# EasyEDA Pro project Car.epro

# Schematic Schematic1

## Sheets
1 OVERVIEW: Assembly Variant: Basic; Board Name: Board1; Create Date: 2025-12-26; Page Name: P1; Project Name: 小车v1.0; Schematic Name: Schematic1; Update Date: 2025-12-26; BladeWidth: 10; Company: 嘉立创EDA; Page Size: A4; RegionStart: 1; ShowBorder: 1; TitleBlock: 1; TitleBlockPosition: 3; Version: V1.0; XRegionCount: 6; YRegionCount: 4
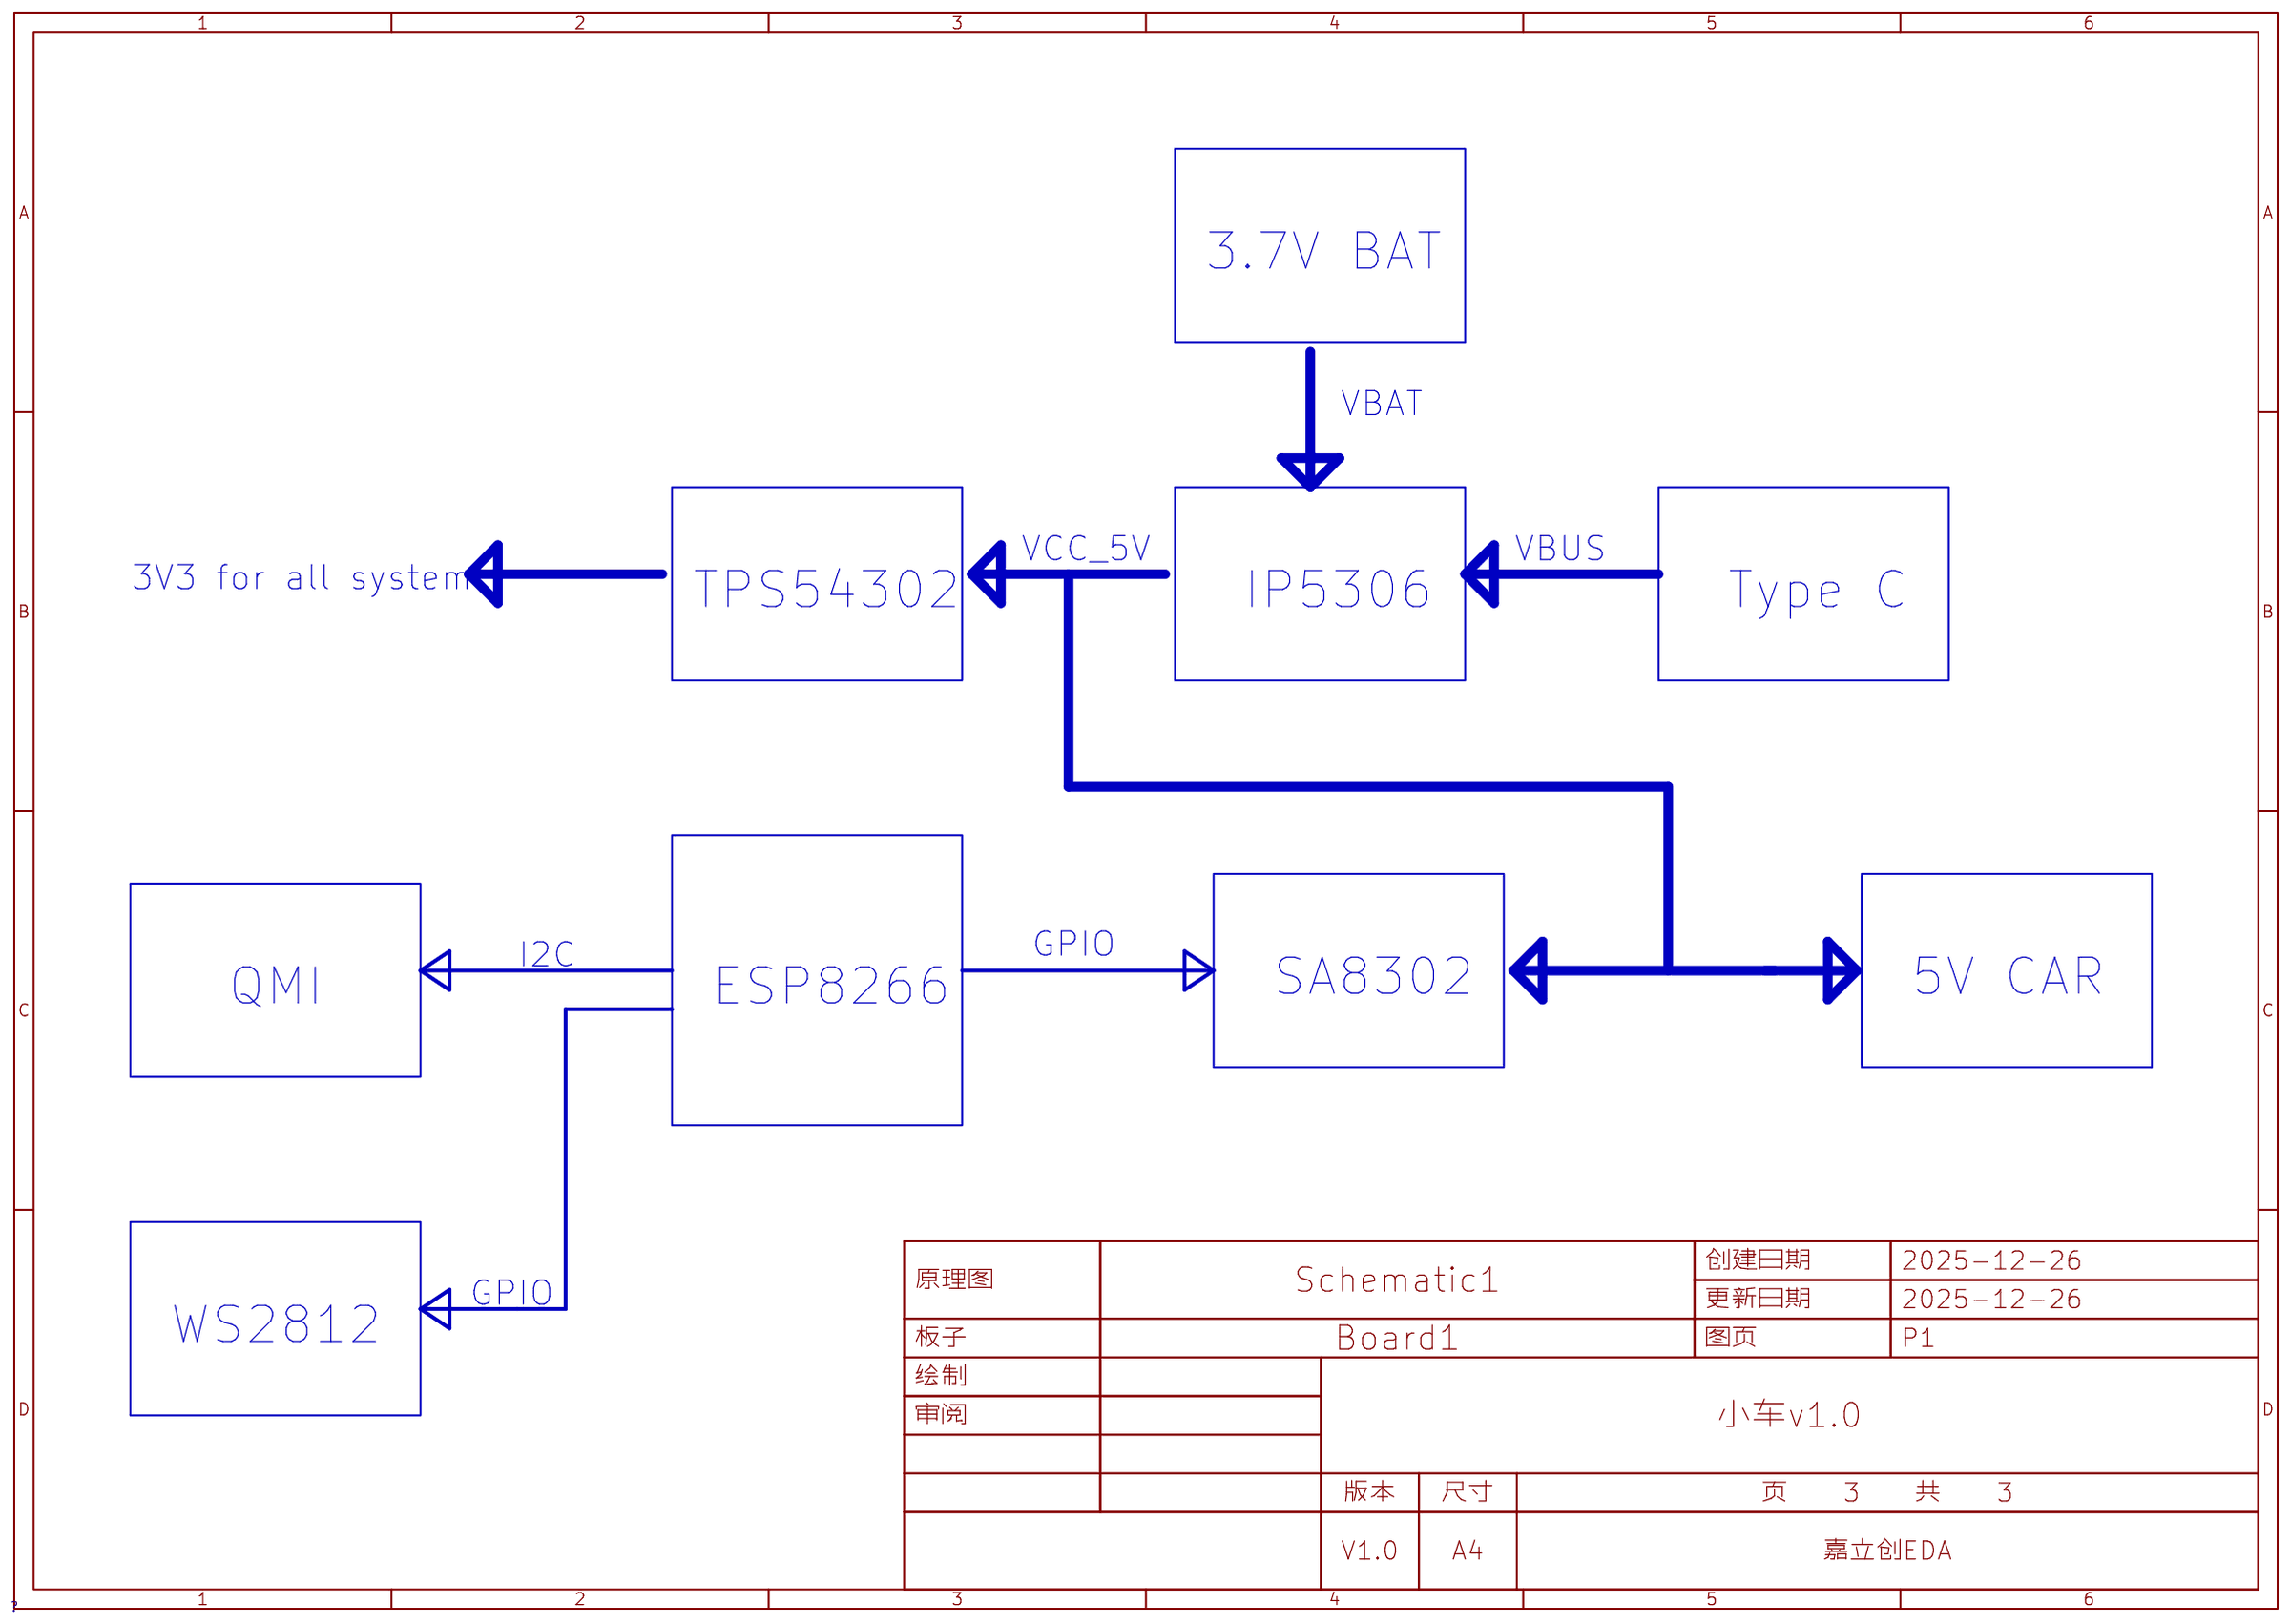
[diagram p0: OVERVIEW]
2 SENSOR: Create Date: 2026-01-07; Update Date: 2026-01-07
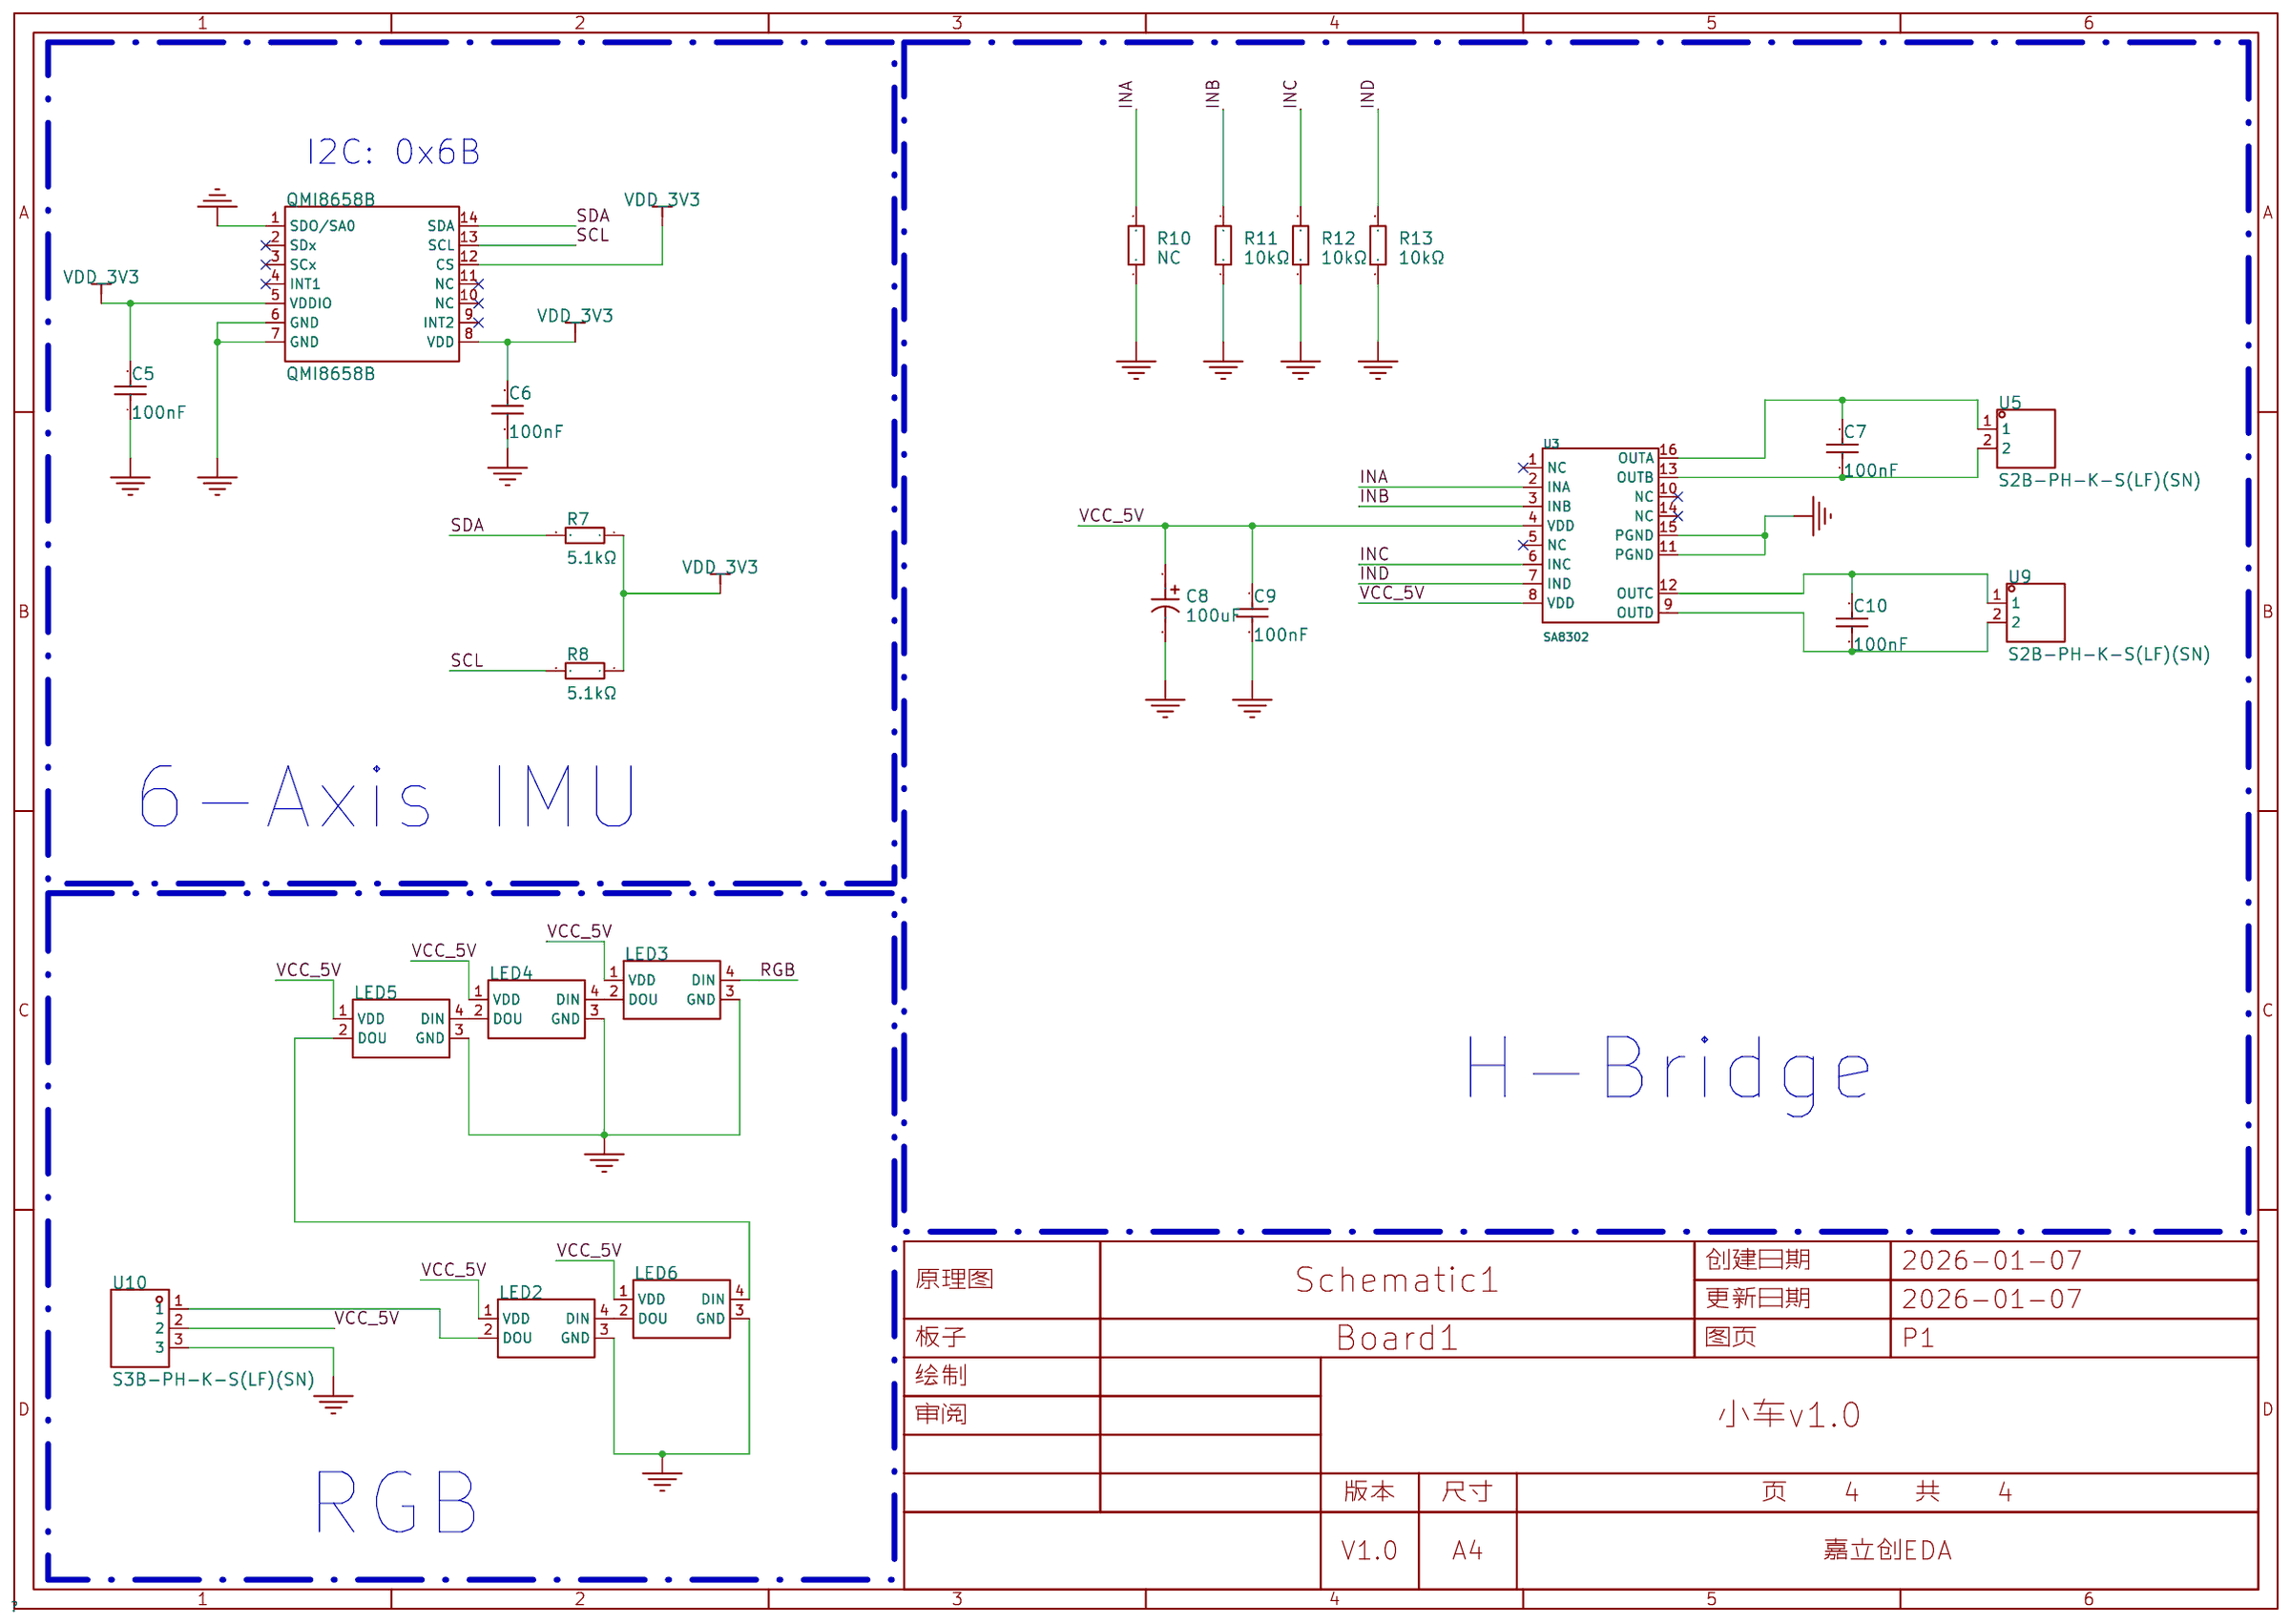
[diagram p1: SENSOR]
3 ESP8266
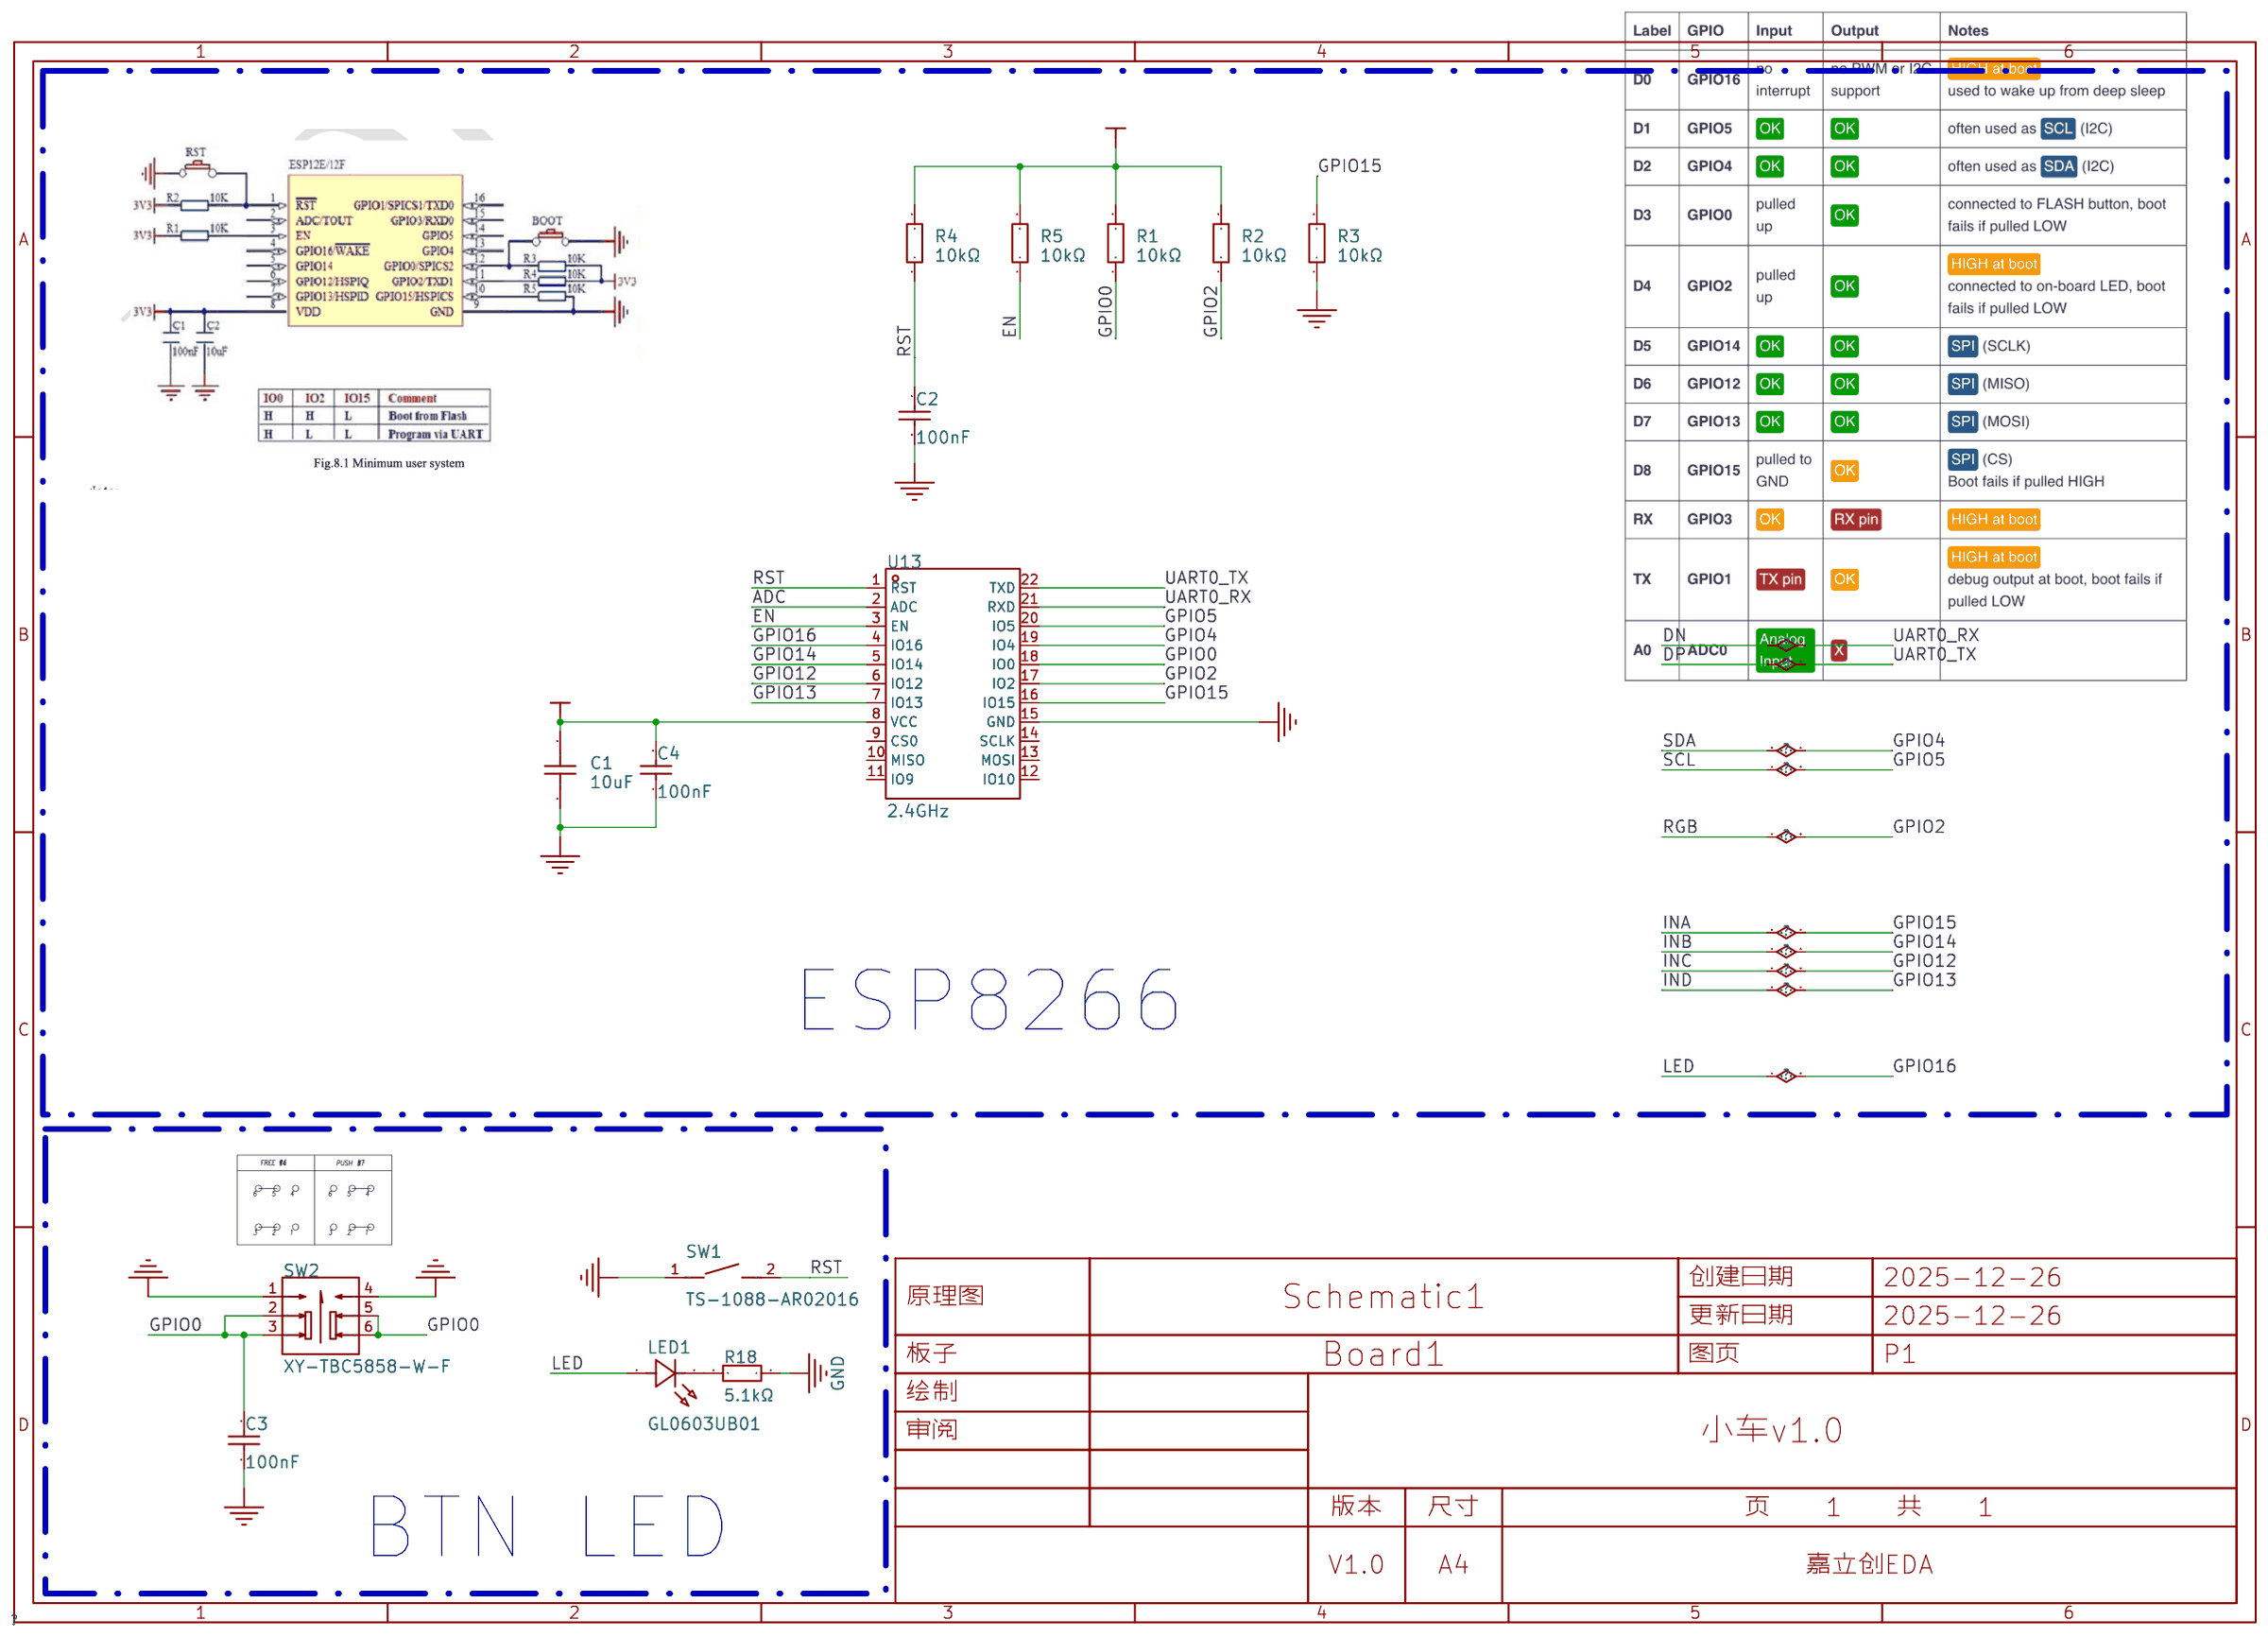
[diagram p2: ESP8266]
4 POWER
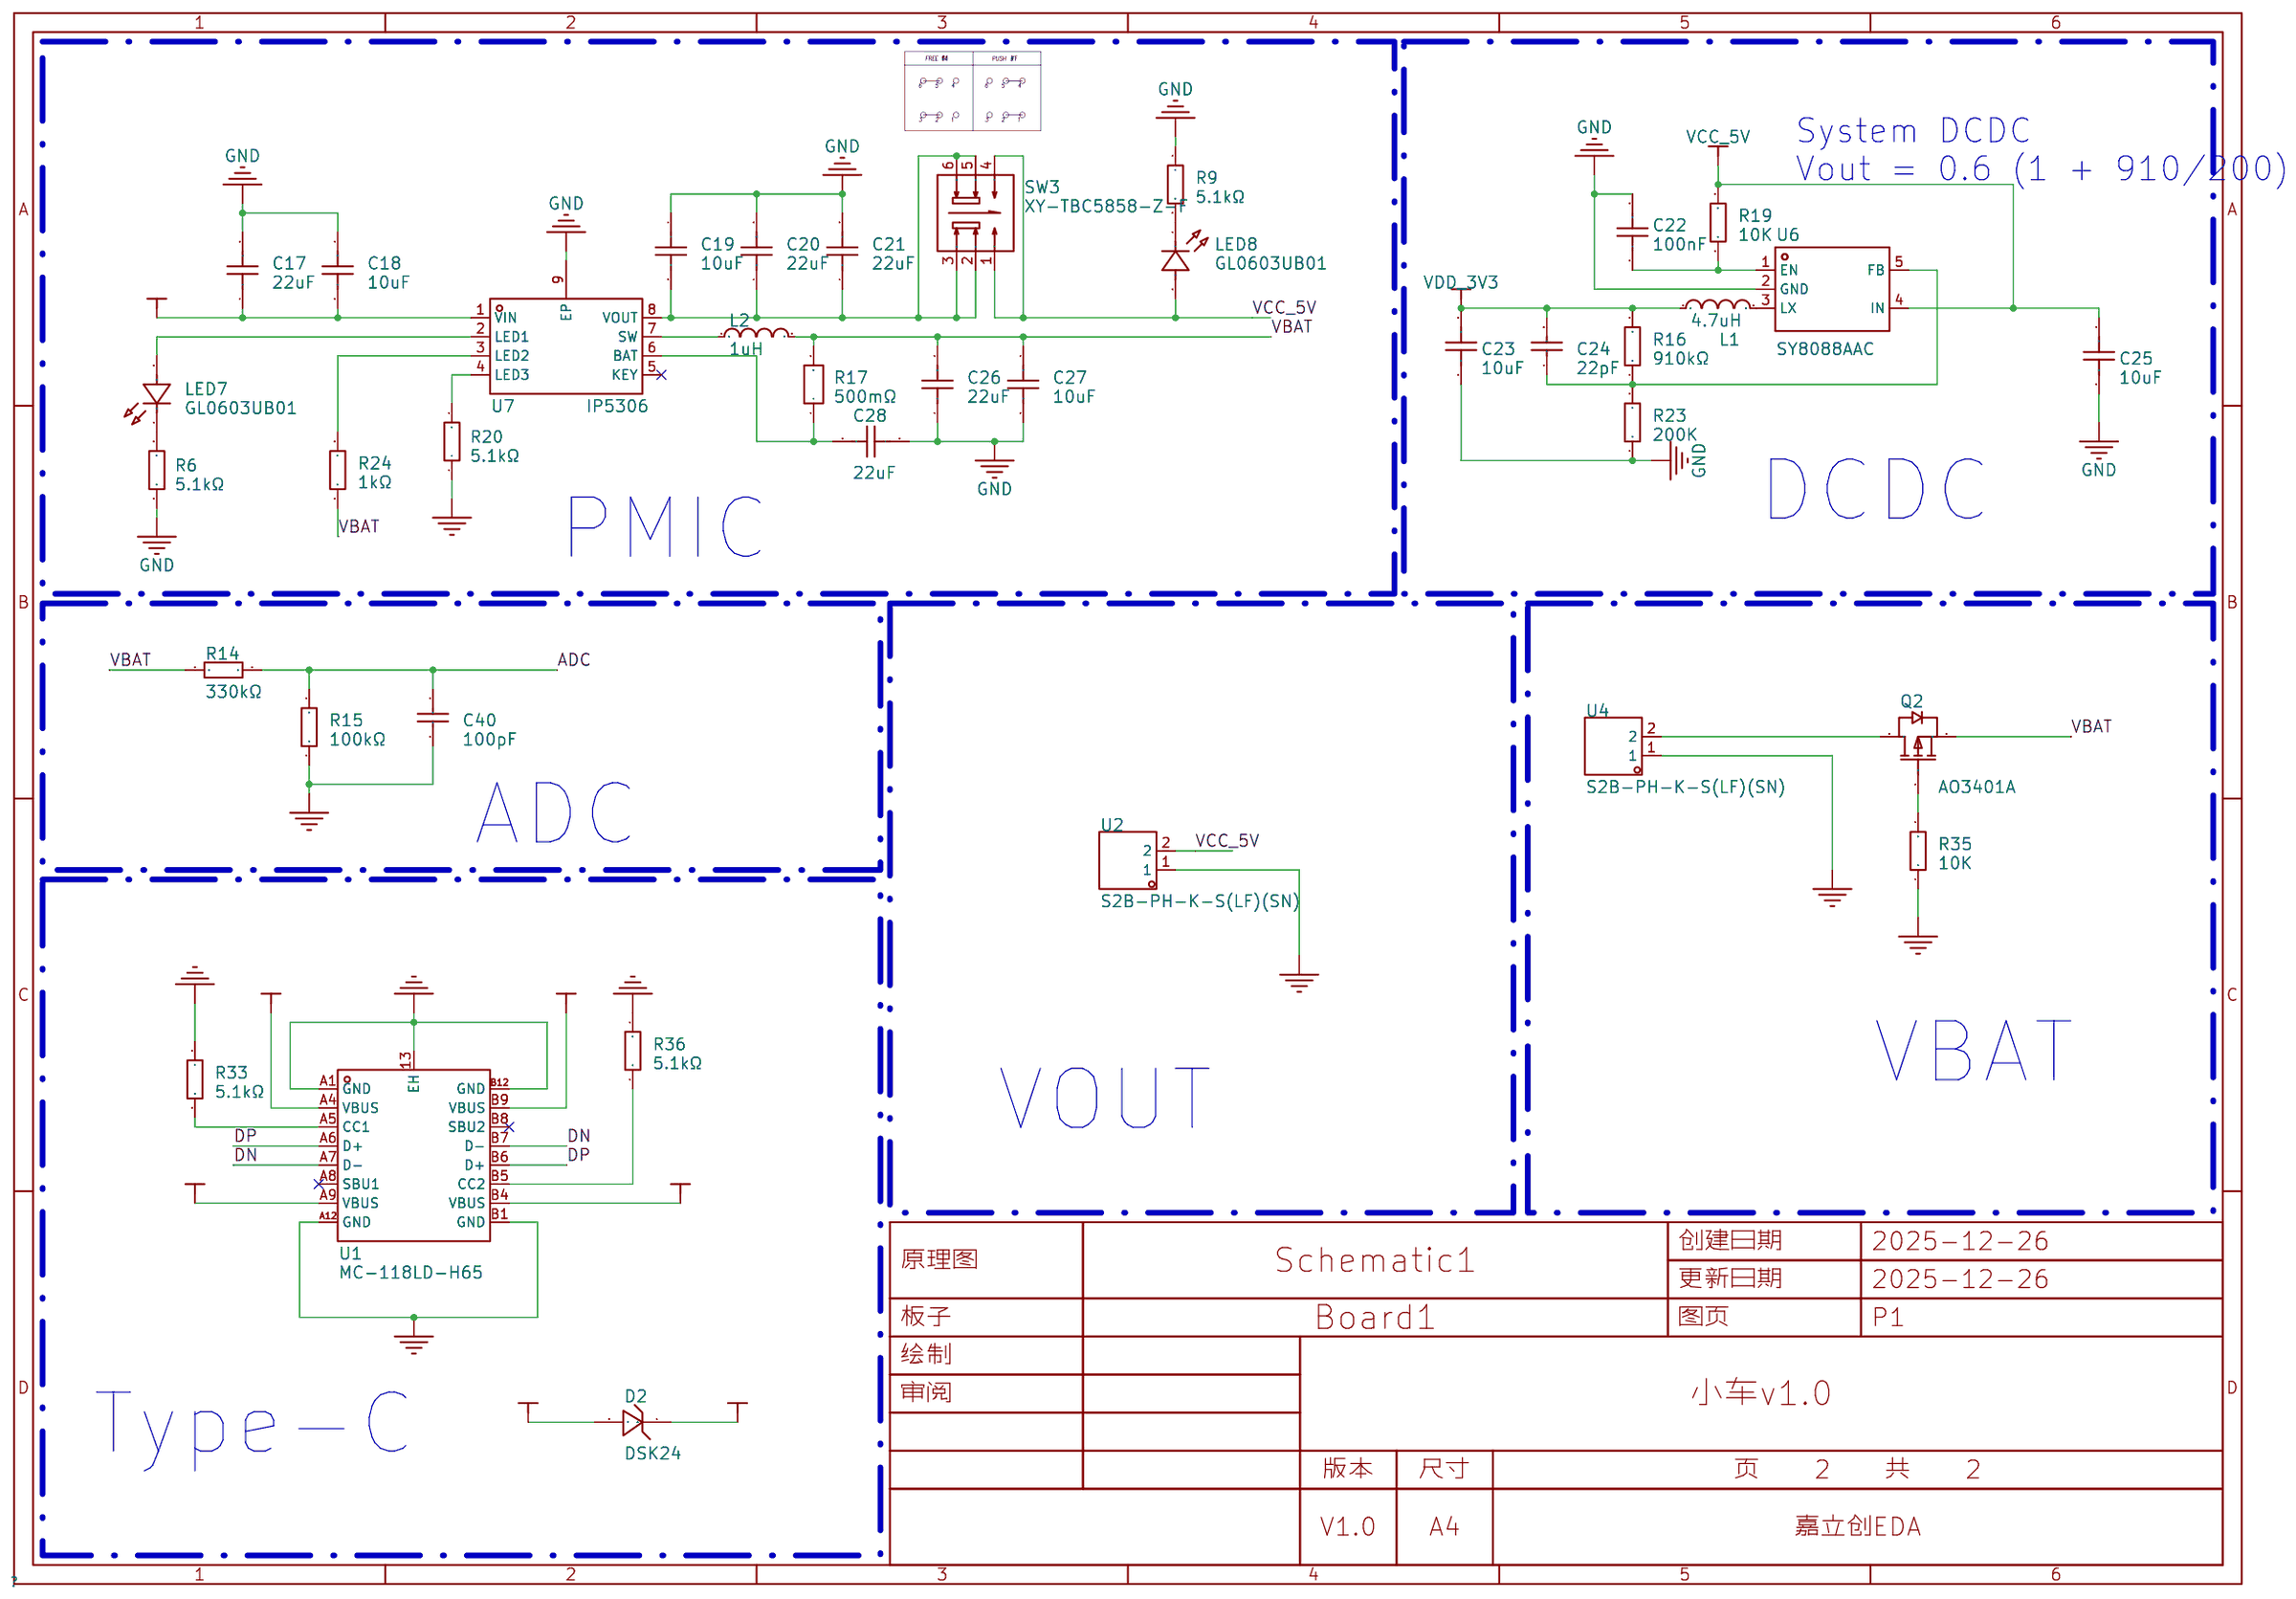
[diagram p3: POWER]

## Parts
sheet ESP8266
C1  10uF  [C0603_1]
C2  100nF  [C0402]
C3  100nF  [C0402]
C4  100nF  [C0402]
LED1  GL0603UB01  [LED0603-RD_BLUE]
R1  10kΩ  [R0402]
R2  10kΩ  [R0402]
R3  10kΩ  [R0402]
R4  10kΩ  [R0402]
R5  10kΩ  [R0402]
R18  5.1kΩ  [R0402]
SW1  TS-1088-AR02016  [SW-SMD_L3.9-W3.0-P4.45]
SW2  XY-TBC5858-W-F  [SW-TH_6P-L5.8-W5.8-P2.00-LS4.5-BL]
U13  2.4GHz  [WIRELM-SMD_ESP-12F]
sheet POWER
C17  22uF  [C0603_1]
C18  10uF  [C0603_1]
C19  10uF  [C0603_1]
C20  22uF  [C0603_1]
C21  22uF  [C0603_1]
C22  100nF  [C0402_1]
C23  10uF  [C0603_2]
C24  22pF  [C0402_1]
C25  10uF  [C0603_2]
C26  22uF  [C0603_1]
C27  10uF  [C0603_1]
C28  22uF  [C0603_1]
C40  100pF  [C0402_1]
D2  DSK24  [SOD-123FL_L2.7-W1.8-LS3.8-RD]
L1  4.7uH  [L0806]
L2  1uH  [IND-SMD_L4.4-W4.2]
LED7  GL0603UB01  [LED0603-RD_BLUE]
LED8  GL0603UB01  [LED0603-RD_BLUE]
Q2  AO3401A  [SOT-23_L2.9-W1.3-P1.90-LS2.4-BR]
R6  5.1kΩ  [R0402]
R9  5.1kΩ  [R0402]
R14  330kΩ  [R0603]
R15  100kΩ  [R0603]
R16  910kΩ  [R0603]
R17  500mΩ  [R0603]
R19  10K  [R0402_1]
R20  5.1kΩ  [R0402]
R23  200K  [R0402_1]
R24  1kΩ  [R0402_1]
R33  5.1kΩ  [R0402]
R35  10K  [R0402_1]
R36  5.1kΩ  [R0402]
SW3  XY-TBC5858-Z-F  [SW-TH_6P-L5.8-W5.8-P2.00-LS4.5-BL]
U1  MC-118LD-H65  [USB-C-TH_HANBO_MC-118LD-H65]
U2  S2B-PH-K-S(LF)(SN)  [CONN-TH_S2B-PH-K-S-LF-SN]
U4  S2B-PH-K-S(LF)(SN)  [CONN-TH_S2B-PH-K-S-LF-SN]
U6  SY8088AAC  [SOT-23-5_L3.0-W1.7-P0.95-LS2.8-BR_1]
U7  IP5306  [ESOP-8_L4.9-W3.9-P1.27-LS6.0-BL-EP]
sheet SENSOR
C5  100nF  [C0402]
C6  100nF  [C0402]
C7  100nF  [C0402]
C8  100uF  [CAP-SMD_BD6.3-L6.6-W6.6-LS7.3-FD]
C9  100nF  [C0402]
C10  100nF  [C0402]
LED2  XL-5050RGBC-2812B  [LED-SMD_4P-L5.0-W5.0-BL_XL-5050RGBC]
LED3  XL-5050RGBC-2812B  [LED-SMD_4P-L5.0-W5.0-BL_XL-5050RGBC]
LED4  XL-5050RGBC-2812B  [LED-SMD_4P-L5.0-W5.0-BL_XL-5050RGBC]
LED5  XL-5050RGBC-2812B  [LED-SMD_4P-L5.0-W5.0-BL_XL-5050RGBC]
LED6  XL-5050RGBC-2812B  [LED-SMD_4P-L5.0-W5.0-BL_XL-5050RGBC]
QMI8658B  QMI8658B  [LGA-14_L3.0-W2.5-P0.50-TL_QMI8658A]
R7  5.1kΩ  [R0402]
R8  5.1kΩ  [R0402]
R10  NC  [R0402]
R11  10kΩ  [R0402]
R12  10kΩ  [R0402]
R13  10kΩ  [R0402]
U3  SA8302  [SOP-16_L10.0-W3.9-P1.27-LS6.0-BL]
U5  S2B-PH-K-S(LF)(SN)  [CONN-TH_S2B-PH-K-S-LF-SN]
U9  S2B-PH-K-S(LF)(SN)  [CONN-TH_S2B-PH-K-S-LF-SN]
U10  S3B-PH-K-S(LF)(SN)  [CONN-TH_3P-P2.00_S3B-PH-K-S-LF-SN]

## Library data of the parts
C1 C18 C19 C27 = CL10A106KP8NNNC: 容值:10uF;精度:±10%;额定电压:10V;温度系数:X5R;; LCSC Part Name: 10uF ±10% 10V; Supplier Part: C19702; Manufacturer: SAMSUNG(三星); Supplier Footprint: 0603; JLCPCB Part Class: Basic Part; Datasheet: https://item.szlcsc.com/datasheet/CL10A106KP8NNNC/20411.html; Supplier: LCSC; Tolerance: ±10%; Voltage Rating: 10V; Temperature Coefficient: X5R
C2-C7 C9 C10 = CL05B104KO5NNNC: 容值:100nF;精度:±10%;额定电压:16V;材质(温度系数):X7R;; LCSC Part Name: 100nF ±10% 16V; Supplier Part: C1525; Manufacturer: SAMSUNG(三星); Supplier Footprint: 0402; Datasheet: https://atta.szlcsc.com/upload/public/pdf/source/20160218/1457707763339.pdf; Supplier: LCSC; Tolerance: ±10%; Voltage Rated: 16V; Temperature Coefficient: X7R; Check: true
LED1 LED7 LED8 = GL0603UB01: 发光颜色:蓝色;正向压降(Vf):2.9V;正向电流:20mA;波长:460nm~469nm;二极管配置:独立二极管;透镜颜色:无色透明透镜;发光强度:72mcd;发光角度:120°;载带方式:正贴;工作温度:-40℃~+85℃;; LCSC Part Name: 0603 蓝灯 高亮; Supplier Part: C51933294; Manufacturer: Guiguang light(桂光光电); Supplier Footprint: 0603; JLCPCB Part Class: Extended Part; Datasheet: https://item.szlcsc.com/datasheet/GL0603UB01/54645990.html; Supplier: LCSC; Illumination Color: 蓝色; Voltage - Forward(Vf): 2.9V; Forward Current: 20mA; Wavelength - Dominant: 460nm~469nm; Diode Configuration: 独立二极管; Lens Color: 无色透明透镜; Luminous Intensity: 72mcd; Viewing Angle: 120°; Mounting Style: 正贴; Operating Temperature: -40℃~+85℃
R1-R5 R10-R13 = 0402WGF1002TCE: 电阻类型:厚膜电阻;阻值:10kΩ;精度:±1%;功率:62.5mW;最大工作电压:50V;温度系数:±100ppm/℃;; LCSC Part Name: 10kΩ ±1% 62.5mW 厚膜电阻; Supplier Part: C25744; Manufacturer: UNI-ROYAL(厚声); Supplier Footprint: 0402; JLCPCB Part Class: 基础库; Datasheet: https://atta.szlcsc.com/upload/public/pdf/source/20200306/C422600_1E6D84923E4A46A82E41ADD87F860B5C.pdf; Supplier: LCSC; Type: 厚膜电阻; Tolerance: ±1%; Power(Watts): 62.5mW; Overload Voltage (Max): 50V; Temperature Coefficient: ±100ppm/℃; Operating Temperature Range: -55℃~+155℃; Check: true
R6-R9 R18 R20 R33 R36 = 0402WGF5101TCE: 电阻类型:厚膜电阻;阻值:5.1kΩ;精度:±1%;功率:62.5mW;; LCSC Part Name: 5.1kΩ±1%62.5mW; Supplier Part: C25905; Manufacturer: UNI-ROYAL(厚声); Supplier Footprint: 0402; JLCPCB Part Class: BasicPart; Datasheet: https://atta.szlcsc.com/upload/public/pdf/source/20200306/C422600_1E6D84923E4A46A82E41ADD87F860B5C.pdf; Supplier: LCSC; Type: 厚膜电阻; Tolerance: ±1%; Power(Watts): 62.5mW; Temperature Coefficient: ±100ppm/℃; Overload Voltage (Max): 50V; Operating Temperature Range: -55℃~+155℃; Check: false
SW1 = TS-1088-AR02016: 电路结构:单刀单掷;按钮形状:圆形按钮;作用力:160gf;安装方式:立贴;开关长度:4mm;开关宽度:3mm;开关高度:2mm;带支架:不带;触点电流:50mA;额定电压(DC):12V;绝缘电阻:100MΩ;机械寿命:10万次;; LCSC Part Name: 4*3*2mm 立贴 轻触开关; Supplier Part: C720477; Manufacturer: XUNPU(讯普); Supplier Footprint: SMD; JLCPCB Part Class: Basic Part; Datasheet: https://atta.szlcsc.com/upload/public/pdf/source/20200810/C720475_60D09DD6C54279ADDB2DC25100F1CC11.pdf; Supplier: LCSC; Circuit: 单刀单掷; Actuator Style: 圆形按钮; Operating Force: 160gf; Mounting Style: 立贴; Switch Length: 4mm; Switch Width: 3mm; Switch Height: 2mm; Strike Gundam: 不带; Contact Current: 50mA; Voltage Rating (DC): 12V; Insulation Resistance: 100MΩ; Actuator/Cap Color: 黑色; Pin Style: SMD接片; Mechanical Life: 10万次; Operating Temperature: -30℃~+80℃
SW2 = XY-TBC5858-W-F: 按键开关 5.8*5.8无锁插件 260gf; LCSC Part Name: 按键开关 5.8*5.8无锁插件 260gf; Supplier Part: C53055049; Manufacturer: XYECONN(辛译); Supplier Footprint: DIP-6P,5.8x5.8mm; JLCPCB Part Class: Extended Part; Datasheet: https://item.szlcsc.com/datasheet/XY-TBC5858-W-F/55998982.html; Supplier: LCSC
U13 = 2.4GHz: LCSC Part Name: ESP8266 WiFi模组,32Mbit Flash, 通用模组; Supplier Part: C19949064; Manufacturer: DOIT(四博智联); Manufacturer Part: ESP-12F; Supplier Footprint: SMD,24x16mm; JLCPCB Part Class: 扩展库; Datasheet: https://item.szlcsc.com/datasheet/ESP-12F/21278194.html; Supplier: LCSC; Wireless Standard: WIFI4; Interface Type: UART; Antenna Type: PCB; Output Power: 15dBm; Voltage - Supply: 3.3V; Receive  Current: 55mA; Send  Current: 375mA; Sensitivity: -96dBm; Operating Temperature: -40℃~+85℃; DesignItemID: ESP-12F
C17 C20 C21 C26 C28 = CL10A226MP8NUNE: 容值:22uF;精度:±20%;额定电压:10V;温度系数:X5R;; LCSC Part Name: 22uF ±20% 10V; Supplier Part: C86295; Manufacturer: SAMSUNG(三星); Supplier Footprint: 0603; JLCPCB Part Class: Extended Part; Datasheet: https://item.szlcsc.com/datasheet/CL10A226MP8NUNE/87471.html; Supplier: LCSC; Tolerance: ±20%; Voltage Rating: 10V; Temperature Coefficient: X5R
C22 = CAP_0402: Supplier Footprint: 0402
C23 C25 = CAP_0603: Supplier Footprint: 0603
C24 = CC0402JRNPO9BN220: 容值:22pF;精度:±5%;额定电压:50V;温度系数:NP0;; LCSC Part Name: 22pF ±5% 50V; Supplier Part: C106203; Manufacturer: YAGEO(国巨); Supplier Footprint: 0402; JLCPCB Part Class: Extended Part; Datasheet: https://item.szlcsc.com/datasheet/CC0402JRNPO9BN220/107418.html; Supplier: LCSC; Tolerance: ±5%; Voltage Rating: 50V; Temperature Coefficient: NP0
C40 = 0402CG101J500NT: 容值:100pF;精度:±5%;额定电压:50V;材质(温度系数):C0G;; LCSC Part Name: 100pF ±5% 50V; Supplier Part: C1546; Manufacturer: FH(风华); Supplier Footprint: 0402; JLCPCB Part Class: Basic Part; Datasheet: https://atta.szlcsc.com/upload/public/pdf/source/20200305/C486355_26A10D38EF8C2A5C37091D0039909270.pdf; Supplier: LCSC; Tolerance: ±5%; Voltage Rated: 50V; Temperature Coefficient: C0G
D2 = DSK24_C22466352: 二极管配置:独立式;正向压降(Vf):550mV@2A;直流反向耐压(Vr):40V;整流电流:2A;; LCSC Part Name: 电压:40V 电流:2A; Supplier Part: C22466352; Manufacturer: R+O(宏嘉诚); Supplier Footprint: SOD-123FL; JLCPCB Part Class: Extended Part; Datasheet: https://item.szlcsc.com/datasheet/DSK24/24165511.html; Supplier: LCSC; Diode Configuration: 独立式; Voltage - Forward(Vf@If): 550mV@2A; Voltage - DC Reverse(Vr): 40V; Current - Rectified: 2A; Reverse Leakage Current (Ir): 500uA@40V; Operating Junction Temperature Range: -55℃~+125℃; Non-Repetitive Peak Forward Surge Current: 50A
L1 = MPL2016S4R7MHT: 电感值:4.7uH;精度:±20%;额定电流:1.1A;饱和电流(Isat):-;直流电阻(DCR):110mΩ;; LCSC Part Name: 4.7uH ±20%; Supplier Part: C98335; Manufacturer: Sunlord(顺络); Supplier Footprint: 0806; JLCPCB Part Class: 扩展库; Datasheet: https://atta.szlcsc.com/upload/public/pdf/source/20190412/C370034_9FF3BE8A5C9DE9022F79DD290567D670.pdf; Supplier: LCSC; Tolerance: ±20%; Rated Current: 1.1A; DC Resistance (DCR): 110mΩ
L2 = FXL0420-1R0-M: 电感值:1uH;精度:±20%;额定电流:6A;饱和电流(Isat):7A;类型:一体成型电感;; LCSC Part Name: 1uH ±20% 7A; Supplier Part: C167203; Manufacturer: cjiang(长江微电); Supplier Footprint: SMD,4.2x4.4mm; JLCPCB Part Class: Extended Part; Datasheet: https://atta.szlcsc.com/upload/public/pdf/source/20240426/3189EA8206330E2108542F9E34E540E7.pdf; Supplier: LCSC; Tolerance: ±20%; Rated Current: 6A; Saturation Current (Isat): 7A; DC Resistance (DCR): 27mΩ; Type: 一体成型电感
Q2 = AO3401A_C15127: 数量:1个P沟道;漏源电压(Vdss):30V;连续漏极电流(Id):4A;导通电阻(RDS(on)):47mΩ@10V；85mΩ@2.5V；60mΩ@4.5V;耗散功率(Pd):-;阈值电压(Vgs(th)):900mV@250uA;; LCSC Part Name: 1个P沟道 耐压:30V 电流:4A; Supplier Part: C15127; Manufacturer: AOS; Supplier Footprint: SOT-23; JLCPCB Part Class: Basic Part; Datasheet: https://item.szlcsc.com/datasheet/AO3401A/15801.html; Supplier: LCSC; Number: 1个P沟道; Drain to Source Voltage: 30V; Current - Continuous Drain(Id): 4A; RDS(on): 47mΩ@10V；85mΩ@2.5V；60mΩ@4.5V; Gate Threshold Voltage (Vgs(th)): 900mV@250uA; Gate Charge(Qg): 14nC@10V; Input Capacitance(Ciss): 645pF; Reverse Transfer Capacitance (Crss@Vds): 55pF; Output Capacitance(Coss): 80pF
R14 = 0603WAF3303T5E: 电阻类型:厚膜电阻;阻值:330kΩ;精度:±1%;功率:100mW;最大工作电压:75V;温度系数:±100ppm/℃;; LCSC Part Name: 330kΩ ±1% 100mW 厚膜电阻; Supplier Part: C23137; Manufacturer: UNI-ROYAL(厚声); Supplier Footprint: 0603; JLCPCB Part Class: Basic Part; Datasheet: https://atta.szlcsc.com/upload/public/pdf/source/20200306/C422600_1E6D84923E4A46A82E41ADD87F860B5C.pdf; Supplier: LCSC; Type: 厚膜电阻; Tolerance: ±1%; Power(Watts): 100mW; Overload Voltage (Max): 75V; Temperature Coefficient: ±100ppm/℃; Operating Temperature Range: -55℃~+155℃
R15 = 0603WAF1003T5E: 电阻类型:厚膜电阻;阻值:100kΩ;精度:±1%;功率:100mW;工作电压:75V;温度系数:±100ppm/℃;; LCSC Part Name: 100kΩ ±1% 100mW 厚膜电阻; Supplier Part: C25803; Manufacturer: UNI-ROYAL(厚声); Supplier Footprint: 0603; JLCPCB Part Class: Basic Part; Datasheet: https://item.szlcsc.com/datasheet/0603WAF1003T5E/26546.html; Supplier: LCSC; Type: 厚膜电阻; Tolerance: ±1%; Power(Watts): 100mW; Voltage-Supply(Max): 75V; Temperature Coefficient: ±100ppm/℃; Operating Temperature: -55℃~+155℃
R16 = 0603WAF9103T5E: 电阻类型:厚膜电阻;阻值:910kΩ;精度:±1%;功率:100mW;最大工作电压:75V;温度系数:±100ppm/℃;; LCSC Part Name: 910kΩ ±1% 100mW 厚膜电阻; Supplier Part: C23263; Manufacturer: UNI-ROYAL(厚声); Supplier Footprint: 0603; JLCPCB Part Class: Extended Part; Datasheet: https://atta.szlcsc.com/upload/public/pdf/source/20200306/C422600_1E6D84923E4A46A82E41ADD87F860B5C.pdf; Supplier: LCSC; Type: 厚膜电阻; Tolerance: ±1%; Power(Watts): 100mW; Overload Voltage (Max): 75V; Temperature Coefficient: ±100ppm/℃; Operating Temperature Range: -55℃~+155℃
R17 = FRL0603JR500TS: 电阻类型:厚膜电阻;阻值:500mΩ;精度:±5%;功率:100mW;工作电压:100V;温度系数:±300ppm/℃;; LCSC Part Name: 500mΩ ±5% 100mW 厚膜电阻; Supplier Part: C2930046; Manufacturer: FOJAN(富捷); Supplier Footprint: 0603; JLCPCB Part Class: Extended Part; Supplier: LCSC; Type: 厚膜电阻; Tolerance: ±5%; Power(Watts): 100mW; Voltage-Supply(Max): 100V; Temperature Coefficient: ±300ppm/℃; Operating Temperature: -55℃~+155℃
R19 R23 R35 = Res_0402: Supplier Footprint: 0402
R24 = 0402WGF1001TCE: 电阻类型:厚膜电阻;阻值:1kΩ;精度:±1%;功率:62.5mW;; LCSC Part Name: 1kΩ ±1% 62.5mW; Supplier Part: C11702; Manufacturer: UNI-ROYAL(厚声); Supplier Footprint: 0402; Datasheet: https://atta.szlcsc.com/upload/public/pdf/source/20200306/C422600_1E6D84923E4A46A82E41ADD87F860B5C.pdf; Supplier: LCSC; Type: 厚膜电阻; Tolerance: ±1%; Power(Watts): 62.5mW; Temperature Coefficient: ±100ppm/℃; Overload Voltage (Max): 50V; Operating Temperature Range: -55℃~+155℃
SW3 = XY-TBC5858-Z-F: 按键开关 5.8*5.8插件自锁 260gf; LCSC Part Name: 按键开关 5.8*5.8插件自锁 260gf; Supplier Part: C53055047; Manufacturer: XYECONN(辛译); Supplier Footprint: DIP-6P,5.8x5.8mm; JLCPCB Part Class: Extended Part; Datasheet: https://item.szlcsc.com/datasheet/XY-TBC5858-Z-F/55998980.html; Supplier: LCSC
U1 = MC-118LD-H65: 连接器类型:Type-C;协议标准:USB 3.1;公母:母;安装方式:直插;触点数量:16P;端口数量:1;额定电流 - 电源:5A;工作温度:-55℃~+85℃;; LCSC Part Name: Type-C 母 直插; Supplier Part: C6332304; Manufacturer: HANBO(汉博); Supplier Footprint: 插件; JLCPCB Part Class: Extended Part; Datasheet: https://item.szlcsc.com/datasheet/MC-118LD-H65/7280544.html; Supplier: LCSC; Connector Type: Type-C; Protocol Standard: USB 3.1; Gender: 母; Mounting Type: 直插; Number of Contacts: 16P; Number of Ports: 1; Current Rating-Power: 5A; Connect-Disconnect Life: 1万次; Length: 6.5mm; Detection color: 黑色; Operating Temperature: -55℃~+85℃
U2 U4 U5 U9 = S2B-PH-K-S(LF)(SN): 插针结构:1x2P;间距:2mm;安装方式:弯插;参考系列:PH;总PIN数:2P;排数:1;每排PIN数:2;行距:-;额定电流:2A;触头材质:黄铜;触头镀层:锡;工作温度:-25℃~+85℃;; LCSC Part Name: 1x2P 间距:2mm 弯插 系列:PH; Supplier Part: C173752; Manufacturer: JST; Supplier Footprint: 弯插,P=2mm; JLCPCB Part Class: Extended Part; Datasheet: https://item.szlcsc.com/datasheet/S2B-PH-K-S(LF)(SN)/185142.html; Supplier: LCSC; Pins Structure: 1x2P; Pitch: 2mm; Mounting Type: 弯插; Reference Series: PH; Number of Pins: 2P; Number of Rows: 1; Number of PINs Per Row: 2; Current Rating: 2A; Contact Material: 黄铜; Contact Plating: 锡; Operating Temperature: -25℃~+85℃; Voltage Rating: 100V; Plastic Material: PA66; Flame Retardant Rating: UL94V-0; Supplementary Features: 打K脚; Color: 白色; Z-Height of the Board: 4.8mm; X-Length of Bottom Edge on Board (Spacing Line): 5.9mm; Y-Width of Bottom Edge on Board: 7.6mm
U6 = SY8088AAC: 功能类型:降压型;同步整流:-;输出通道数:-;拓扑结构:-;输入电压:-;输出电流(最大值):-;开关频率:-;; LCSC Part Name: 降压型; Supplier Part: C79313; Manufacturer: silergy(矽力杰); Supplier Footprint: SOT-23-5; JLCPCB Part Class: 扩展库; Datasheet: https://atta.szlcsc.com/upload/public/pdf/source/20170329/1490752163260.pdf; Supplier: LCSC; Function: 降压型; Voltage - Supply: 2.5V~5.5V; Frequency - Switching: 1.5MHz; Operating Temperature: -40℃~+125℃; Synchronous Rectifier: 是; Quiescent Current: 40uA
U7 = IP5306: 2.1A充电2.4A放电高集成度移动电源SOC; Supplier Part: C181692; Manufacturer: INJOINIC(英集芯); Supplier Footprint: ESOP-8; JLCPCB Part Class: 扩展库; Datasheet: https://atta.szlcsc.com/upload/public/pdf/source/20190627/C384572_9925B3DDC4041BC6108E5AB46A2A0AB1.pdf; Supplier: LCSC
C8 = RT35V100M6X5: 容值:100uF;精度:±20%;额定电压:35V;纹波电流:60mA@120Hz;; LCSC Part Name: 100uF ±20% 35V; Supplier Part: C48971024; Manufacturer: JIERR(捷而瑞); Supplier Footprint: SMD,D6.3xL5.4mm; JLCPCB Part Class: Extended Part; Datasheet: https://item.szlcsc.com/datasheet/RT35V100M6X5/51296229.html; Supplier: LCSC; Tolerance: ±20%; Voltage Rating: 35V; Ripple Current: 60mA@120Hz; Diameter: 6.3mm; Height - Seated (Max): 5.4mm; Lifetime: 2000hrs@105℃; Operating Temperature: -40℃~+105℃
LED2-LED6 = XL-5050RGBC-2812B: 5050幻彩透明  内置驱动  IC WS2812B; LCSC Part Name: XL-5050RGBC-WS2812B; Supplier Part: C2843785; Manufacturer: XINGLIGHT(成兴光); Supplier Footprint: SMD5050-4P; JLCPCB Part Class: Extended Part; Datasheet: https://item.szlcsc.com/datasheet/XL-5050RGBC-2812B/3033136.html; Supplier: LCSC; Wavelength: 465nm~475nm；620nm~635nm；520nm~535nm; Luminous Intensity: R:500mcd~700mcd；B:300mcd~500mcd；G:1300mcd~1800mcd; Fixed-Frequency Pwm Mode: 4kHz; Data Transmission Rate: 800Kbit/s; Voltage - Supply: 3.5V~5.5V; Quiescent Current: 0.3mA; Lens Color: 无色透明透镜; ESD Withstand Voltage: 2000V; Installation method: 正贴; Operating Temperature: -20℃~+85℃; Viewing Angle: 120°; Length: 5mm; Width: 1.6mm; Height: 5mm
QMI8658B = QMI8658B: LCSC Part Name: LSM6DSDTR; Supplier Part: C472550; Manufacturer: ST(意法半导体); Supplier Footprint: LGA-14(2.5x3); JLCPCB Part Class: 扩展库; Datasheet: https://item.szlcsc.com/datasheet/LSM6DSDTR/478759.html; Supplier: LCSC; DesignItemID: LSM6DSDTR
U3 = SA8302: SA8302是为消费类产品，玩具和其他低 压或者电池供电的运动控制类应用提供了 / 一个集成的电机驱动器解决方案。此器件 / 能够驱动一个步进电机或者两路直流无刷 / 电机，由功率PMOS和NMOS组成，集成 / 了电机正转/反转/停止/刹车四个功能; Supplier: 矽塔科技; Manufacturer Part: TC1508S; SMT Type: Extend
U10 = S3B-PH-K-S(LF)(SN): 插针结构:1x3P;间距:2mm;安装方式:弯插;参考系列:PH;总PIN数:3P;排数:1;每排PIN数:3;行距:-;额定电流:2A;触头材质:黄铜;触头镀层:锡;工作温度:-25℃~+85℃;; LCSC Part Name: 1x3P 间距:2mm 弯插 系列:PH; Supplier Part: C157929; Manufacturer: JST; Supplier Footprint: 弯插,P=2mm; JLCPCB Part Class: Extended Part; Datasheet: https://item.szlcsc.com/datasheet/S3B-PH-K-S(LF)(SN)/169277.html; Supplier: LCSC; Pins Structure: 1x3P; Pitch: 2mm; Mounting Type: 弯插; Reference Series: PH; Number of Pins: 3P; Number of Rows: 1; Number of PINs Per Row: 3; Current Rating: 2A; Contact Material: 黄铜; Contact Plating: 锡; Operating Temperature: -25℃~+85℃; Voltage Rating: 100V; Plastic Material: PA66; Flame Retardant Rating: UL94V-0; Supplementary Features: 打K脚; Color: 白色; Z-Height of the Board: 4.8mm; X-Length of Bottom Edge on Board (Spacing Line): 7.9mm; Y-Width of Bottom Edge on Board: 7.6mm

## Nets
GND: C1.1 C2.1 C3.1 C4.1 C5.1 C6.1 C8.2 C9.1 C17.2 C18.1 C19.1 C20.2 C21.2 C22.2 C23.1 C25.1 C26.1 C27.2 C28.1 C40.1 LED2.3(GND) LED3.3(GND) LED4.3(GND) LED5.3(GND) LED6.3(GND) QMI8658B.1(SDO/SA0) QMI8658B.6(GND) QMI8658B.7(GND) R3.1 R6.1 R9.1 R10.1 R11.1 R12.1 R13.1 R15.1 R18.1 R20.1 R23.1 R33.1 R35.1 R36.1 SW1.1 SW2.1 SW2.4 U1.13(EH) U1.A1(GND) U1.A12(GND) U1.B1(GND) U1.B12(GND) U2.1 U3.11(PGND) U3.15(PGND) U4.1 U6.2(GND) U7.9(EP) U10.3 U13.15(GND)
VBAT: C26.2 C27.1 L2.2 Q2.2(S) R14.1 R17.2 R24.1
VBUS: C17.1 C18.2 D2.1(C) U7.1(VIN)
VBUS_IN: D2.2(A) U1.A4(VBUS) U1.A9(VBUS) U1.B4(VBUS) U1.B9(VBUS)
VCC_5V: C8.1 C9.2 C25.2 LED2.1(VDD) LED3.1(VDD) LED4.1(VDD) LED5.1(VDD) LED6.1(VDD) LED8.2(A) R19.2 SW3.1 SW3.4 U2.2 U3.4(VDD) U3.8(VDD) U6.4(IN) U10.2
VDD_3V3: C1.2 C4.2 C5.2 C6.2 C23.2 C24.2 L1.1 QMI8658B.5(VDDIO) QMI8658B.8(VDD) QMI8658B.12(CS) R1.2 R2.2 R4.2 R5.2 R7.1 R8.1 R16.2 U13.8(VCC)
ADC: C40.2 R14.2 R15.2 U13.2(ADC)
DN: U1.A7(D-) U1.B7(D-) U13.21(RXD)
DP: U1.A6(D+) U1.B6(D+) U13.22(TXD)
EN: R5.1 U13.3(EN)
GPIO0: C3.2 R1.1 SW2.2 SW2.3 SW2.5 SW2.6 U13.18(IO0)
GPIO2: LED3.4(DIN) R2.1 U13.17(IO2)
GPIO4: QMI8658B.14(SDA) R7.2 U13.19(IO4)
GPIO5: QMI8658B.13(SCL) R8.2 U13.20(IO5)
GPIO12: R12.2 U3.6(INC) U13.6(IO12)
GPIO13: R13.2 U3.7(IND) U13.7(IO13)
GPIO14: R11.2 U3.3(INB) U13.5(IO14)
GPIO15: R3.2 R10.2 U3.2(INA) U13.16(IO15)
GPIO16: LED1.2(A) U13.4(IO16)
RST: C2.2 R4.1 SW1.2 U13.1(RST)
$1N81: LED1.1(K) R18.2
$2N6: C19.2 C20.1 C21.1 SW3.2 SW3.3 SW3.5 SW3.6 U7.8(VOUT)
$2N8: LED7.2(A) U7.2(LED1)
$2N12: R24.2 U7.3(LED2)
$2N14: L2.1 U7.7(SW)
$2N15: C28.2 R17.1 U7.6(BAT)
$2N47: Q2.1(G) R35.2
$2N48: Q2.3(D) U4.2
$2N77: LED7.1(K) R6.2
$2N94: L1.2 U6.3(LX)
$2N96: C24.1 R16.1 R23.2 U6.5(FB)
$2N97: C22.1 R19.1 U6.1(EN)
$2N102: LED8.1(K) R9.2
$2N120: R20.2 U7.4(LED3)
$2N126: R33.2 U1.A5(CC1)
$2N135: R36.2 U1.B5(CC2)
$4N37: LED3.2(DOU) LED4.4(DIN)
$4N38: LED4.2(DOU) LED5.4(DIN)
$4N39: LED5.2(DOU) LED6.4(DIN)
$4N53: C7.2 U3.16(OUTA) U5.1
$4N54: C7.1 U3.13(OUTB) U5.2
$4N56: C10.1 U3.9(OUTD) U9.2
$4N57: C10.2 U3.12(OUTC) U9.1
$4N71: LED2.4(DIN) LED6.2(DOU)
$4N72: LED2.2(DOU) U10.1

Not connected (* = marked no-connect by the designer): QMI8658B 2(SDx)* 3(SCx)* 4(INT1)* 9(INT2)* 10(NC)* 11(NC)*; U1 A8(SBU1)* B8(SBU2)*; U3 1(NC)* 5(NC)* 10(NC)* 14(NC)*; U7 5(KEY)*; U13 9(CS0) 10(MISO) 11(IO9) 12(IO10) 13(MOSI) 14(SCLK)

## Notes on the sheets
sheet 1
- 3.7V BAT
- VBAT
- VCC_5V
- VBUS
- 3V3 for all system
- TPS54302
- IP5306
- Type C
- GPIO
- I2C
- SA8302
- 5V CAR
- QMI
- ESP8266
- GPIO
- WS2812
sheet 2
- I2C: 0x6B
- 6-Axis IMU
- H-Bridge
- RGB
sheet 3
- ESP8266
- BTN LED
sheet 4
- System DCDC
- Vout = 0.6 (1 + 910/200)
- DCDC
- PMIC
- ADC
- VBAT
- VOUT
- Type-C

# Board PCB1
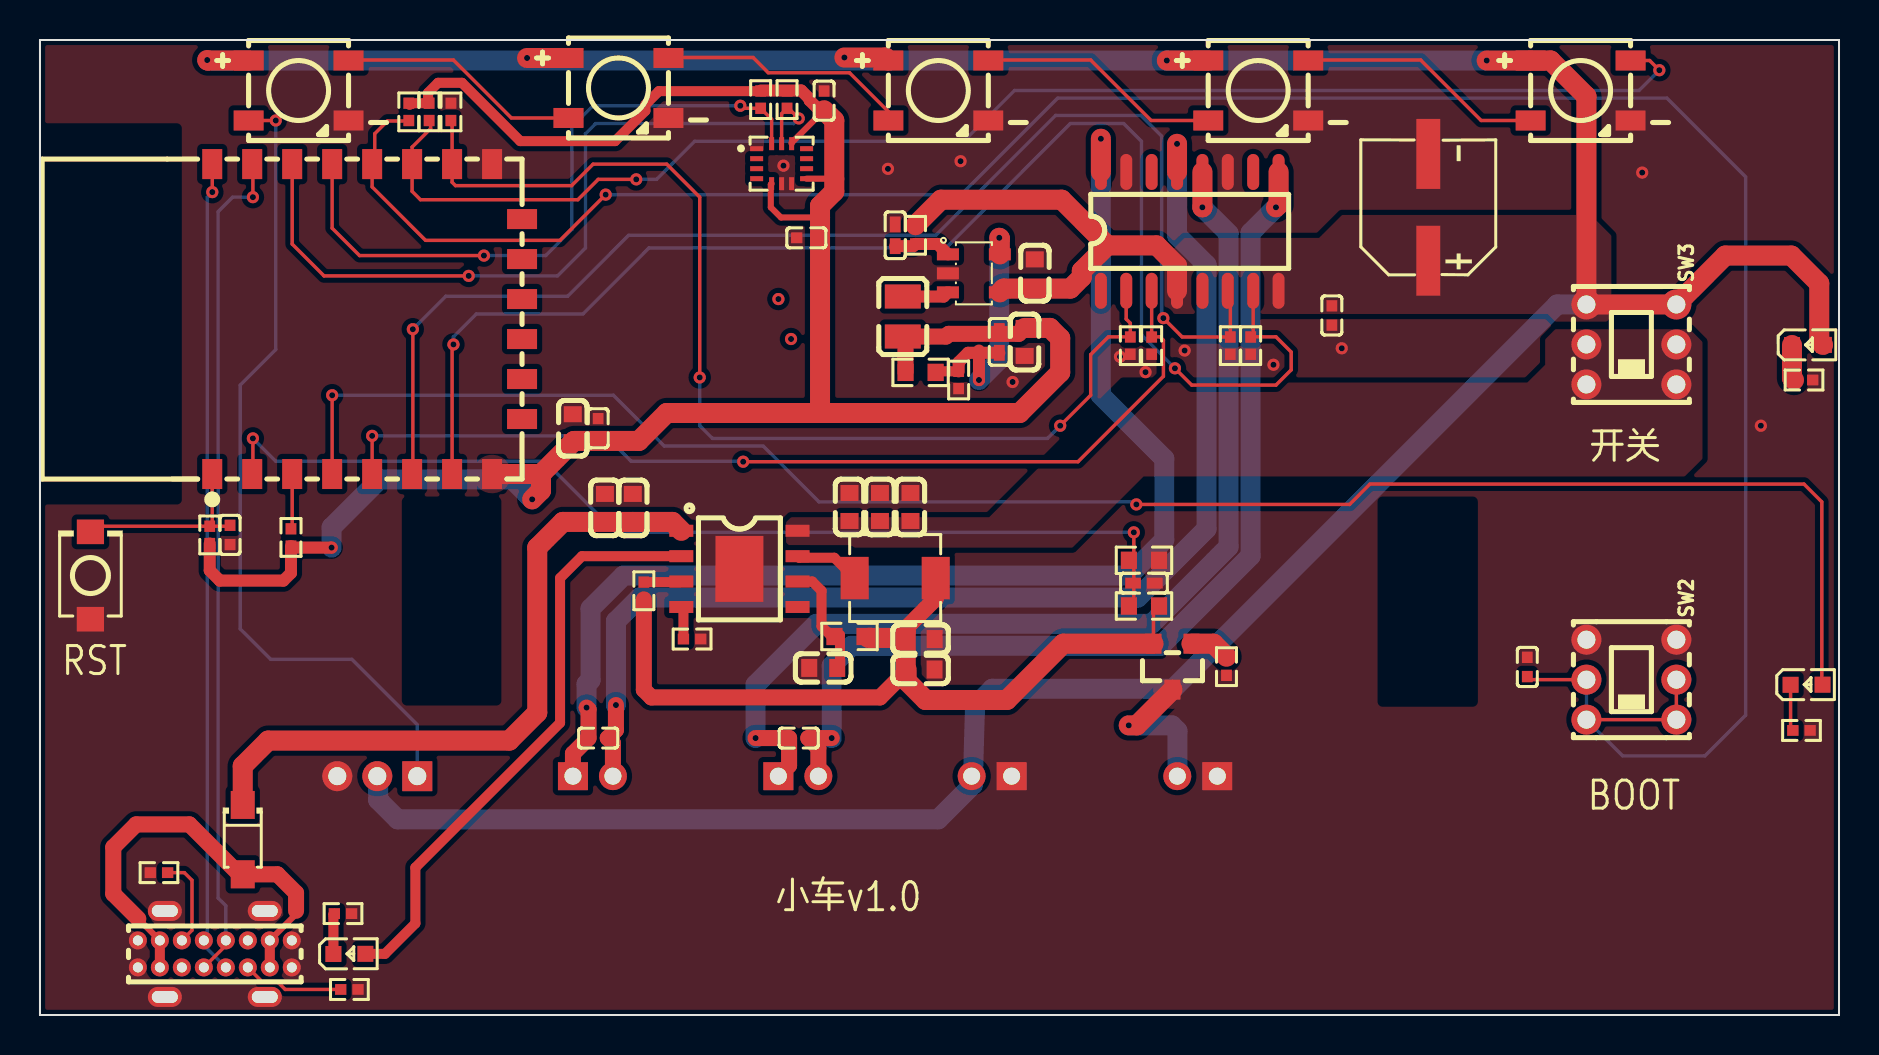
[diagram p4: board, top side]
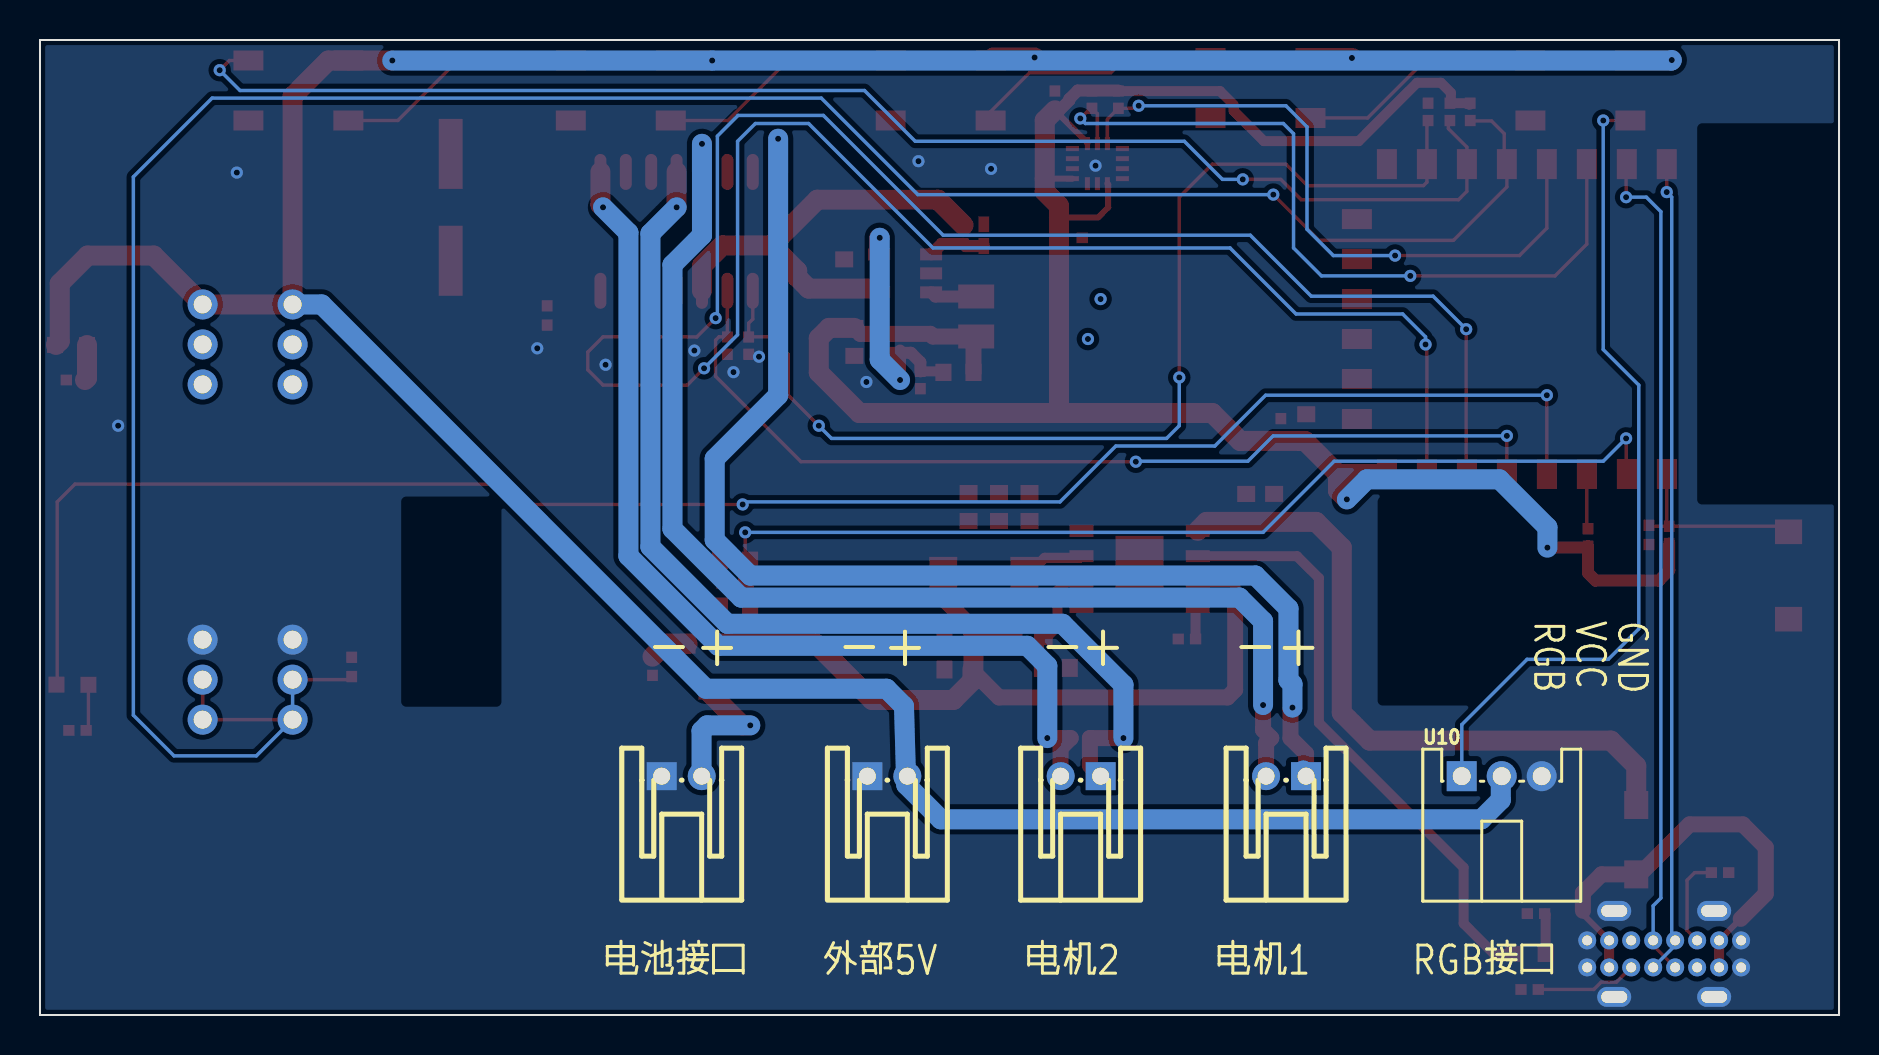
[diagram p5: board, bottom side, seen from below]

Outline 90 x 48.76 mm; copper layers: Top Layer, Bottom Layer. Coordinates in mm from the lower left corner of the outline.
Outline path: 0,48.76 90,48.76 90,0 0,0 0,48.76
Stack: Top Layer 0.035mm / Dielectric1 1.51mm FR4 er 4.5 / Bottom Layer 0.035mm

## Design rules (mm)
spacing copperThickness1oz (default): track to track 0.102, other pairs 0.152 to 0.3
spacing copperThickness2oz: track to track 0.203, other pairs 0.152 to 0.3
track width copperThickness1oz (default): min 0.127, default 0.17, max 2.54
track width copperThickness2oz: min 0.203, default 0.254, max 2.54
differential pair differentialPair (default): width min 0.127, default 0.254, max 2.54; gap min 0.152, default 0.152
net GND uses copperRegion
net VCC_5V uses copperRegion
net $2N6 uses copperRegion

## Placement (name value [footprint] x y rotation side)
C1  10uF  [C0603_1]  26.65 29.34 270 top
C2  100nF  [C0402]  9.51 24.01 90 top
C3  100nF  [C0402]  74.41 17.41 270 top
C4  100nF  [C0402]  27.92 29.34 270 top
C5  100nF  [C0402]  38.34 38.87 0 top
C6  100nF  [C0402]  39.23 45.73 270 top
C7  100nF  [C0402]  27.92 13.85 180 top
C8  100uF  [CAP-SMD_BD6.3-L6.6-W6.6-LS7.3-FD]  69.45 40.39 90 top
C9  100nF  [C0402]  64.63 34.99 90 top
C10  100nF  [C0402]  37.96 13.85 180 top
C17  22uF  [C0603_1]  29.66 25.36 90 top
C18  10uF  [C0603_1]  28.26 25.36 270 top
C19  10uF  [C0603_1]  42.02 25.41 270 top
C20  22uF  [C0603_1]  40.5 25.41 90 top
C21  22uF  [C0603_1]  43.55 25.41 90 top
C22  100nF  [C0402_1]  42.78 39 90 top
C23  10uF  [C0603_2]  49.26 33.66 90 top
C24  22pF  [C0402_1]  47.99 33.66 90 top
C25  10uF  [C0603_2]  49.77 37.09 270 top
C26  22uF  [C0603_1]  44.05 17.28 180 top
C27  10uF  [C0603_1]  44.05 18.8 0 top
C28  22uF  [C0603_1]  39.18 17.36 0 top
C40  100pF  [C0402_1]  55.23 21.6 180 top
D2  DSK24  [SOD-123FL_L2.7-W1.8-LS3.8-RD]  10.14 8.77 270 top
L1  4.7uH  [L0806]  43.16 34.93 90 top
L2  1uH  [IND-SMD_L4.4-W4.2]  42.78 21.85 180 top
LED1  GL0603UB01  [LED0603-RD_BLUE]  88.38 16.52 0 top
LED2  XL-5050RGBC-2812B  [LED-SMD_4P-L5.0-W5.0-BL_XL-5050RGBC]  12.94 46.24 270 top
LED3  XL-5050RGBC-2812B  [LED-SMD_4P-L5.0-W5.0-BL_XL-5050RGBC]  77.07 46.24 270 top
LED4  XL-5050RGBC-2812B  [LED-SMD_4P-L5.0-W5.0-BL_XL-5050RGBC]  60.94 46.24 270 top
LED5  XL-5050RGBC-2812B  [LED-SMD_4P-L5.0-W5.0-BL_XL-5050RGBC]  44.94 46.24 270 top
LED6  XL-5050RGBC-2812B  [LED-SMD_4P-L5.0-W5.0-BL_XL-5050RGBC]  28.94 46.36 270 top
LED7  GL0603UB01  [LED0603-RD_BLUE]  15.48 3.06 0 top
LED8  GL0603UB01  [LED0603-RD_BLUE]  88.45 33.51 0 top
Q2  AO3401A  [SOT-23_L2.9-W1.3-P1.90-LS2.4-BR]  56.65 17.42 90 top
QMI8658B  QMI8658B  [LGA-14_L3.0-W2.5-P0.50-TL_QMI8658A]  37.1 42.58 0 top
R1  10kΩ  [R0402]  18.45 45.17 90 top
R2  10kΩ  [R0402]  19.47 45.17 90 top
R3  10kΩ  [R0402]  20.56 45.17 270 top
R4  10kΩ  [R0402]  8.49 24.01 270 top
R5  10kΩ  [R0402]  12.56 23.88 270 top
R6  5.1kΩ  [R0402]  15.16 5.07 180 top
R7  5.1kΩ  [R0402]  36.05 45.78 270 top
R8  5.1kΩ  [R0402]  37.37 45.78 270 top
R9  5.1kΩ  [R0402]  88.25 31.76 180 top
R10  NC  [R0402]  54.55 33.48 90 top
R11  10kΩ  [R0402]  55.61 33.48 90 top
R12  10kΩ  [R0402]  59.55 33.48 90 top
R13  10kΩ  [R0402]  60.57 33.48 90 top
R14  330kΩ  [R0603]  55.23 20.45 180 top
R15  100kΩ  [R0603]  55.23 22.74 180 top
R16  910kΩ  [R0603]  44.05 32.14 180 top
R17  500mΩ  [R0603]  40.5 18.93 0 top
R18  5.1kΩ  [R0402]  88.12 14.23 180 top
R19  10K  [R0402_1]  43.8 39 90 top
R20  5.1kΩ  [R0402]  32.62 18.8 180 top
R23  200K  [R0402_1]  45.96 31.76 90 top
R24  1kΩ  [R0402_1]  30.21 21.22 90 top
R33  5.1kΩ  [R0402]  5.95 7.12 0 top
R35  10K  [R0402_1]  59.36 17.42 90 top
R36  5.1kΩ  [R0402]  15.48 1.28 180 top
SW1  TS-1088-AR02016  [SW-SMD_L3.9-W3.0-P4.45]  2.52 21.98 90 top
SW2  XY-TBC5858-W-F  [SW-TH_6P-L5.8-W5.8-P2.00-LS4.5-BL]  79.61 16.77 270 top
SW3  XY-TBC5858-Z-F  [SW-TH_6P-L5.8-W5.8-P2.00-LS4.5-BL]  79.61 33.54 270 top
U1  MC-118LD-H65  [USB-C-TH_HANBO_MC-118LD-H65]  8.75 3.06 0 top
U2  S2B-PH-K-S(LF)(SN)  [CONN-TH_S2B-PH-K-S-LF-SN#2]  47.61 11.95 0 bottom
U3  SA8302  [SOP-16_L10.0-W3.9-P1.27-LS6.0-BL]  57.52 39.19 0 top
U4  S2B-PH-K-S(LF)(SN)  [CONN-TH_S2B-PH-K-S-LF-SN#2]  57.9 11.95 0 bottom
U5  S2B-PH-K-S(LF)(SN)  [CONN-TH_S2B-PH-K-S-LF-SN]  27.66 11.95 0 bottom
U6  SY8088AAC  [SOT-23-5_L3.0-W1.7-P0.95-LS2.8-BR_1]  46.72 37.09 180 top
U7  IP5306  [ESOP-8_L4.9-W3.9-P1.27-LS6.0-BL-EP]  34.99 22.31 270 top
U9  S2B-PH-K-S(LF)(SN)  [CONN-TH_S2B-PH-K-S-LF-SN]  37.94 11.95 0 bottom
U10  S3B-PH-K-S(LF)(SN)  [CONN-TH_3P-P2.00_S3B-PH-K-S-LF-SN]  16.88 11.94 180 bottom
U13  2.4GHz  [WIRELM-SMD_ESP-12F]  14.84 34.81 90 top

## Footprints (pads in the part's own frame, mm; a bottom-side part is the same pattern mirrored in y, then rotated)
C0402
  rect 0.566x0.54 smd: 1(-0.481,0) 2(0.481,0)
C0402_1
  rect 0.79x0.54 smd: 1(-0.545,0) 2(0.545,0)
C0603_1
  rect 0.8x0.9 smd: 1(-0.7,0) 2(0.7,0)
C0603_2
  rect 0.8x0.9 smd: 1(-0.7,0) 2(0.7,0)
CAP-SMD_BD6.3-L6.6-W6.6-LS7.3-FD
  rect 3.5x1.2 smd: 1(-2.67,0) 2(2.67,0)
CONN-TH_3P-P2.00_S3B-PH-K-S-LF-SN
  rect 1.5x1.5 hole 0.9: 1(-2,0)
  round 1.5 hole 0.9: 2(0,0) 3(2,0)
CONN-TH_S2B-PH-K-S-LF-SN
  rect 1.5x1.4 hole 0.85: 1(-1,0)
  round 1.4 hole 0.85: 2(1,0)
CONN-TH_S2B-PH-K-S-LF-SN#2
  rect 1.5x1.4 hole 0.85: 1(1,0)
  round 1.4 hole 0.85: 2(-1,0)
ESOP-8_L4.9-W3.9-P1.27-LS6.0-BL-EP
  rect 0.6x1.2 smd: 1(-1.905,-2.909) 2(-0.635,-2.909) 3(0.635,-2.909) 4(1.905,-2.909) 5(1.905,2.909) 6(0.635,2.909) 7(-0.635,2.909) 8(-1.905,2.909)
  rect 3.3x2.4 smd: 9(0,0)
IND-SMD_L4.4-W4.2
  rect 1.4x2.12 smd: 1(2.028,0) 2(-2.028,0)
L0806
  rect 1.2x1.8 smd: 1(-1,0) 2(1,0)
LED0603-RD_BLUE
  rect 0.8x0.8 smd: 1(-0.799,-0.004) 2(0.799,0.004)
LED-SMD_4P-L5.0-W5.0-BL_XL-5050RGBC
  rect 1x1.5 smd: 1(-1.5,-2.5) 2(1.5,-2.5) 3(1.5,2.5) 4(-1.5,2.5)
LGA-14_L3.0-W2.5-P0.50-TL_QMI8658A
  rect 0.65x0.25 smd: 1(-1.25,0.75) 2(-1.25,0.25) 3(-1.25,-0.25) 4(-1.25,-0.75) 8(1.25,-0.75) 9(1.25,-0.25) 10(1.25,0.25) 11(1.25,0.75)
  rect 0.25x0.65 smd: 5(-0.5,-1) 6(0,-1) 7(0.5,-1) 12(0.5,1) 13(0,1) 14(-0.5,1)
R0402
  rect 0.566x0.54 smd: 1(-0.433,0) 2(0.433,0)
R0402_1
  rect 0.566x0.54 smd: 1(-0.433,0) 2(0.433,0)
R0603
  rect 0.806x0.864 smd: 1(-0.753,0) 2(0.753,0)
SOD-123FL_L2.7-W1.8-LS3.8-RD
  rect 1.4x1.2 smd: 1(-1.735,0) 2(1.735,0)
SOP-16_L10.0-W3.9-P1.27-LS6.0-BL
  oval 0.6x1.8 smd: 1(-4.445,-2.972) 2(-3.175,-2.972) 3(-1.905,-2.972) 4(-0.635,-2.972) 5(0.635,-2.972) 6(1.905,-2.972) 7(3.175,-2.972) 8(4.445,-2.972) 9(4.445,2.972) 10(3.175,2.972) 11(1.905,2.972) 12(0.635,2.972) 13(-0.635,2.972) 14(-1.905,2.972) 15(-3.175,2.972) 16(-4.445,2.972)
SOT-23-5_L3.0-W1.7-P0.95-LS2.8-BR_1
  rect 1.1x0.6 smd: 1(1.3,-0.95) 2(1.3,0) 3(1.3,0.95) 4(-1.3,0.95) 5(-1.3,-0.95)
SOT-23_L2.9-W1.3-P1.90-LS2.4-BR
  rect 1x0.8 smd: 1(1.15,-0.95) 2(1.15,0.95) 3(-1.15,0)
SW-SMD_L3.9-W3.0-P4.45
  rect 1.23x1.36 smd: 1(-2.185,0) 2(2.185,0)
SW-TH_6P-L5.8-W5.8-P2.00-LS4.5-BL
  round 1.5 hole 0.9: 1(-2,-2.25) 2(0,-2.25) 3(2,-2.25) 4(-2,2.25) 5(0,2.25) 6(2,2.25)
USB-C-TH_HANBO_MC-118LD-H65
  oval 1.7x1 hole 1.3x0.6: 13(-2.5,2.15) 13(-2.5,-2.15) 13(2.5,2.15) 13(2.5,-2.15)
  round 0.9 hole 0.5: A1(-3.85,0.675) A4(-2.75,0.675) A5(-1.65,0.675) A6(-0.55,0.675) A7(0.55,0.675) A8(1.65,0.675) A9(2.75,0.675) A12(3.85,0.675) B1(3.85,-0.675) B4(2.75,-0.675) B5(1.65,-0.675) B6(0.55,-0.675) B7(-0.55,-0.675) B8(-1.65,-0.675) B9(-2.75,-0.675) B12(-3.85,-0.675)
WIRELM-SMD_ESP-12F
  rect 1.5x1 smd: 1(-7.75,6.226) 2(-7.75,4.226) 3(-7.75,2.226) 4(-7.75,0.226) 5(-7.75,-1.774) 6(-7.75,-3.774) 7(-7.75,-5.774) 8(-7.75,-7.774) 15(7.75,-7.774) 16(7.75,-5.774) 17(7.75,-3.774) 18(7.75,-1.774) 19(7.75,0.226) 20(7.75,2.226) 21(7.75,4.226) 22(7.75,6.226)
  rect 1x1.5 smd: 9(-5,-9.274) 10(-3,-9.274) 11(-1,-9.274) 12(1,-9.274) 13(3,-9.274) 14(5,-9.274)

## Nets
As in the schematic.

Pads without a net: QMI8658B 2 3 4 9 10 11; U1 A8 B8; U3 1 5 10 14; U7 5; U13 9 10 11 12 13 14

## Via types
v1: diameter 0.61, hole 0.305, Top Layer to Bottom Layer, 53 vias

## Routing (per net, layer and track width the routed paths; a pad name or vN(x,y) marks a point on that pad's centre or on a via; arc(x,y) is an arc through that point)
GND:
  vias: v1(37.19,42.48) v1(42.42,42.32) v1(46.05,42.7) v1(48.66,31.66) v1(54.03,32.92) v1(55.31,32.15) v1(57.26,33.23) v1(61.71,32.52) v1(65.12,33.34) v1(80.15,42.13) v1(86.09,29.47)
VBAT: length 42.5
  Top Layer w0.17: 55.66,20.58 55.7,20.54 Q2.2
  Top Layer w0.8: R24.1 30.21,16.26 30.59,15.88 42.02,15.88 43.31,17.17 ; L2.2 44.81,20.83 43.35,19.37 C27.1
  Top Layer w1: Q2.2 51.19,18.57 48.37,15.76 44.31,15.76 43.35,16.71 C26.2 ; 43.31,17.17 43.31,19.17 43.3,19.18 42.98,18.86 41.45,18.86
VBUS: length 34
  Top Layer w1: U7.1 31.64,24.66 C17.1 26.16,24.66 24.88,23.38 24.88,15.12 23.48,13.72 11.41,13.72 10.14,12.45 D2.1
VBUS_IN: length 22.1
  Top Layer w0.3: U1.A4 4.92,4.81 ; 12.81,5.04 U1.A9
  Top Layer w0.5: 11.5,2.38 U1.A9 ; U1.A4 6,2.38
  Top Layer w0.8: 12.81,5.21 12.81,6.1 11.88,7.04 D2.2 9.97,7.04 7.48,9.53 4.81,9.53 3.67,8.39 3.67,6.06 4.92,4.81
VCC_5V: length 202.7
  Top Layer w1: v1(56.37,47.74) LED4.1 ; 53.4,38.49 52.12,37.21 52.12,36.9 51.55,36.33 48.21,36.33 U6.4 ; 53.4,38.49 55.86,38.49 56.88,37.47 56.88,36.22 ; 53.4,38.49 51.11,40.77 45.08,40.77 43.8,39.5 ; LED5.1 42.29,47.89 v1(40.24,47.89) ; LED2.1 8.39,47.74 v1(8.37,47.76) ; 89.2,33.51 89.01,33.7 89.01,36.58 87.61,37.98 84.31,37.98 SW3.4 SW3.1 77.36,45.95 75.57,47.74 LED3.1 v1(72.37,47.74) ; LED6.1 v1(24.37,47.86)
  Bottom Layer w1: v1(8.37,47.76) 8.39,47.74 v1(56.37,47.74) v1(72.37,47.74) ; U10.2 16.92,11.9 16.92,10.76 17.89,9.79 44.94,9.79 46.67,11.52 46.78,15.45 47.65,16.32 56.69,16.32 75.91,35.54 SW3.1
VDD_3V3: length 112.9
  Top Layer w0.3: 39.74,41.82 39.73,41.83 QMI8658B.8 ; C6.2 37.6,43.62 QMI8658B.12 ; QMI8658B.5 36.56,41.54 36.56,40.39 37.07,39.89 39.02,39.89
  Top Layer w0.5: 35.95,46.21 30.96,46.21 30.29,45.53 30.29,45.22 28.77,43.71 24.03,43.71 21.11,46.62 19.91,46.62 19.42,46.12 19.42,45.6 ; 18.49,45.52 18.57,45.6 19.42,45.6 ; 19.42,45.6 19.46,45.6
  Top Layer w0.6: R4.2 8.49,22.23 9,21.72 12.18,21.72 12.56,22.11 R5.2 ; v1(14.59,23.38) 12.63,23.38 ; C6.2 39,45.25 38.51,45.74 38.51,45.81 38.08,46.24 36.08,46.24
  Top Layer w0.8: R16.2 43.3,33.8 L1.1 45.33,33.93 45.46,34.06 48.96,34.06 C23.2
  Top Layer w1: 39.02,30.11 31.35,30.11 29.96,28.71 26.72,28.71 C1.2 25.07,27.06 ; 39.02,30.11 49.01,30.11 51.04,32.14 51.04,33.85 50.52,34.36 C23.2 ; 39.02,30.11 39.02,40.47 39.74,41.18 39.74,44.74 C6.2 ; 25.07,27.06 25.07,26.23 v1(24.62,25.79) ; 25.07,27.06 U13.8
  Bottom Layer w1: v1(14.59,23.38) 14.59,24.39 16.99,26.79 23.62,26.79 v1(24.62,25.79)
ADC: length 51.4
  Top Layer w0.17: U13.2 10.65,27.09 v1(10.65,28.84) ; 54.8,20.58 54.72,20.66 v1(54.72,24.14)
  Bottom Layer w0.17: v1(10.65,28.84) 11.8,27.69 25.26,27.69 28.81,24.14 v1(54.72,24.14)
DN: length 42.1
  Top Layer w0.17: 8.2,2.38 9.3,3.48 U1.A7 ; U13.21 10.65,42.52 v1(10.65,40.9)
  Bottom Layer w0.17: v1(10.65,40.9) 9.64,40.9 8.91,40.18 8.91,5.85 9.3,5.46 U1.A7
DP: length 40.8
  Top Layer w0.17: v1(8.62,41.16) 8.62,42.55 U13.22
  Bottom Layer w0.17: v1(8.62,41.16) 8.37,40.91 8.37,3.9 U1.A6 8.2,3.48 9.3,2.38
EN: length 2.8
  Top Layer w0.17: U13.3 12.62,24.38 R5.1
GPIO0: length 127.1
  Top Layer w0.17: v1(28.3,41.03) 26.02,38.74 19.29,38.74 16.62,41.41 U13.18 16.75,42.69 16.75,44.08 17.38,44.71 18.32,44.71 ; SW2.2 74.56,16.77 74.28,17.05 ; SW2.5 SW2.6 SW2.3
  Bottom Layer w0.17: SW2.2 SW2.3 79.17,12.96 83.3,12.96 85.33,14.99 85.33,41.92 81.39,45.85 50.91,45.85 46.09,41.03 v1(28.3,41.03)
GPIO2: length 70.9
  Top Layer w0.17: LED3.4 80.53,47.74 v1(81.01,47.25) ; v1(29.83,41.79) 27.92,41.79 26.91,40.77 19.03,40.77 18.62,41.19 U13.17 18.62,43.41 19.54,44.33 19.54,44.53 19.34,44.73
  Bottom Layer w0.17: v1(81.01,47.25) 79.99,46.24 48.75,46.24 46.21,43.7 32.75,43.7 30.85,41.79 v1(29.83,41.79)
GPIO4: length 33.4
  Top Layer w0.17: v1(22.21,37.98) 15.99,37.98 14.62,39.35 U13.19 ; QMI8658B.14 36.6,44.8 R7.2 35.16,45.35 v1(35.04,45.47)
  Bottom Layer w0.17: v1(22.21,37.98) 25.3,37.98 26.61,39.3 26.61,44.42 27.67,45.47 v1(35.04,45.47)
GPIO5: length 39.3
  Top Layer w0.17: QMI8658B.13 37.1,45.07 R8.2 37.45,45.35 v1(37.96,44.84) ; v1(21.45,36.96) 14.21,36.96 12.62,38.56 U13.20
  Bottom Layer w0.17: v1(21.45,36.96) 25.89,36.96 27.29,38.36 27.29,44.08 27.8,44.58 37.7,44.58 v1(37.96,44.84)
GPIO9:
  vias: v1(37.57,33.81)
GPIO10:
  vias: v1(36.94,35.81)
GPIO12: length 64.8
  Top Layer w0.17: v1(18.65,34.3) 18.65,27.09 U13.6 ; 59.42,36.22 59.55,36.09 R12.2 57.14,33.91 v1(56.2,34.85)
  Bottom Layer w0.17: v1(56.2,34.85) 56.11,34.94 56.11,43.96 55.08,44.99 50.81,44.99 44.82,39 29.45,39 26.4,35.95 20.3,35.95 v1(18.65,34.3)
GPIO13: length 70.2
  Top Layer w0.17: U13.7 20.62,33.47 v1(20.69,33.54) ; 60.57,33.92 60.69,34.04 60.69,36.22 ; 60.57,33.92 61.83,33.92 62.6,33.15 62.6,32.27 61.83,31.5 57.62,31.5 v1(56.78,32.34) ; 60.57,33.92 R13.2
  Bottom Layer w0.17: v1(20.69,33.54) 20.69,33.92 21.83,35.06 27.16,35.06 30.46,38.36 45.32,38.36 51.55,44.58 54.21,44.58 55.1,43.7 55.1,34.02 v1(56.78,32.34)
GPIO14: length 48.6
  Top Layer w0.17: U13.5 v1(16.62,28.96) ; 55.61,36.22 R11.2 55.62,33.92 56.03,33.92 56.2,33.75 56.2,31.94 51.93,27.67 v1(35.18,27.67)
  Bottom Layer w0.17: v1(35.18,27.67) 35.16,27.69 29.58,27.69 28.31,28.96 v1(16.62,28.96)
GPIO15: length 55.6
  Top Layer w0.17: 20.43,44.66 20.62,44.47 U13.16 20.62,41.65 20.79,41.48 26.6,41.48 27.67,42.55 31.35,42.55 33,40.9 v1(33,31.88) ; 54.34,36.22 54.34,36.22 54.34,34.81 54.55,34.6 R10.2 54.54,33.92 53.45,33.92 52.56,33.03 52.56,31 v1(51.04,29.47)
  Bottom Layer w0.17: v1(51.04,29.47) 50.4,28.84 33.64,28.84 33,29.47 v1(33,31.88)
GPIO16: length 90.7
  Top Layer w0.17: U13.4 v1(14.62,31) ; LED1.2 89.14,16.56 89.14,25.66 88.25,26.55 66.53,26.55 65.52,25.53 v1(54.85,25.53)
  Bottom Layer w0.17: v1(54.85,25.53) 54.72,25.66 38.97,25.66 36.18,28.46 31.23,28.46 28.69,31 v1(14.62,31)
RST: length 9.9
  Top Layer w0.17: R4.1 9.39,24.44 9.51,24.56 9.51,24.61 ; R4.1 8.62,24.57 U13.1 ; R4.1 2.8,24.44 SW1.2
$1N81: length 2.3
  Top Layer w0.17: LED1.1 87.58,14.34 R18.2
$2N8: length 29.9
  Top Layer w0.5: LED7.2 17.26,3.06 18.78,4.58 18.78,7.37 26.02,14.61 26.02,21.85 27.11,22.95 32.08,22.95
$2N12: length 1.9
  Top Layer w0.5: U7.3 32.06,21.65 R24.2
$2N14: length 3.3
  Top Layer w0.5: 37.9,22.95 37.98,22.87 39.74,22.87 L2.1
$2N15: length 6
  Top Layer w0.5: C28.2 40.02,17.5 40.02,19.01 39.53,19.01 39.1,19.44 39.1,21.22 38.64,21.68 U7.6
$2N47: length 2
  Top Layer w1: Q2.1 58.71,18.57 59.36,17.92
$2N48: length 7.7
  Top Layer w1: v1(54.47,14.49) 54.87,14.49 Q2.3
  Bottom Layer w1: v1(54.47,14.49) 56.63,14.49 56.9,14.21 56.9,11.95 U4.2
$2N77: length 2
  Top Layer w0.5: LED7.1 14.68,5.02 R6.2
$2N94: length 2.3
  Top Layer w0.6: U6.3 45.21,35.93 L1.2
$2N96: length 13.7
  Top Layer w0.5: 45.96,32.19 44.86,32.19 R16.1
  Top Layer w0.6: 46.97,33.12 46.43,33.12 45.96,32.65 45.96,32.19 ; 46.97,33.12 C24.1 ; 46.97,33.12 46.97,33.23 ; 46.97,33.12 v1(46.97,31.76)
  Top Layer w1: v1(47.99,38.87) 48.02,38.84 U6.5
  Bottom Layer w1: v1(46.97,31.76) 47.99,32.77 v1(47.99,38.87)
$2N97: length 2.9
  Top Layer w0.6: U6.1 44.9,38.56 R19.1 43.69,38.45 C22.1
$2N102: length 1.8
  Top Layer w1: 87.75,31.76 87.65,31.86 LED8.1
$2N120: length 1.6
  Top Layer w0.5: R20.2 32.19,20.3 U7.4
$2N126: length 4.6
  Top Layer w0.17: U1.A5 7.6,4.24 7.6,6.74 7.22,7.12 R33.2
$2N135: length 5.1
  Top Layer w0.17: 10.4,2.38 11.14,1.64 11.9,1.64 12.27,1.28 15.05,1.28
$4N37: length 12.4
  Top Layer w0.17: LED4.4 63.47,47.76 69.07,47.76 72.1,44.74 LED3.2
$4N38: length 12.3
  Top Layer w0.17: LED4.2 55.59,44.74 52.56,47.76 47.47,47.76 LED5.4
$4N39: length 12.6
  Top Layer w0.17: LED6.4 31.46,47.89 35.67,47.89 36.43,47.12 40.5,47.12 42.44,45.18 LED5.2
$4N53: length 62.2
  Top Layer w0.8: U5.1 26.66,13.07 C7.2 27.44,15.28 v1(27.34,15.37)
  Top Layer w1: U3.16 v1(53.07,43.82)
  Bottom Layer w1: 26.8,12.23 26.66,12.09 ; v1(27.34,15.37) 27.34,16.55 27.54,16.75 27.54,20.33 29.19,21.98 54.47,21.98 56.25,23.76 56.25,27.82 53.07,30.99 v1(53.07,43.82)
$4N54: length 60.8
  Top Layer w0.8: v1(28.81,15.5) 28.81,14.26 C7.1 28.66,13.59 U5.2
  Top Layer w1: U3.13 v1(56.88,43.57)
  Bottom Layer w1: v1(56.88,43.57) 56.88,38.99 58.36,37.52 58.36,24.31 54.92,20.88 30,20.88 28.81,19.69 v1(28.81,15.5) ; 28.65,12.11 28.66,12.09
$4N56: length 49.9
  Top Layer w0.8: v1(39.61,13.85) C10.1 38.94,13.35 U9.2
  Top Layer w1: v1(61.83,40.39) 61.96,40.52 U3.9
  Bottom Layer w1: v1(39.61,13.85) 39.61,17.46 40.61,18.46 56.07,18.46 60.56,22.96 60.56,39.12 v1(61.83,40.39)
$4N57: length 52.3
  Top Layer w0.8: U9.1 37.48,12.48 C10.2 v1(35.8,13.85)
  Top Layer w1: v1(58.15,40.39) 58.15,40.4 U3.12
  Bottom Layer w1: v1(35.8,13.85) 35.8,16.52 38.85,19.57 55.61,19.57 59.46,23.42 59.46,39.08 v1(58.15,40.39)
$4N71: length 12.2
  Top Layer w0.17: LED2.4 15.46,47.76 20.69,47.76 23.58,44.86 LED6.2
$4N72: length 40.9
  Top Layer w0.17: LED2.2 v1(11.8,44.74)
  Bottom Layer w0.17: v1(11.8,44.74) 11.8,33.28 10.02,31.5 10.02,19.31 11.54,17.79 15.61,17.79 18.87,14.52 U10.1

## Copper pours and planes (outline as drawn; the poured copper is in the pictures)
GND on Top Layer: -5.48,52.33 94.73,52.33 94.73,-9.77 -5.48,-9.77
GND on Bottom Layer: -12.21,53.6 108.82,53.6 108.82,-11.42 -12.21,-11.42
VCC_5V on Top Layer: 75.8,34.68 75.42,35.06 56.63,35.06 56.25,35.44 56.25,37.85 57.26,38.87 63.99,38.87 65.14,40.01 77.58,40.01 78.61,38.98 78.61,34.91 78.38,34.68
$2N6 on Top Layer: 37.58,24.9 47.48,24.9 54.21,31.63 74.41,31.63 75.3,32.52 75.3,33.79 75.8,34.3 82.53,34.3 83.17,33.66 83.17,27.82 82.28,26.93 55.21,26.93 51.65,23.38 37.58,23.38 37.32,23.63 37.32,24.65

## Text on the board
Bottom Silkscreen Layer: GND | VCC | RGB | + | - | RGB接口 | 电机1 | 电机2 | 外部5V | 电池接口
Top Silkscreen Layer: RST | BOOT | 小车v1.0 | 开关
